# EAGLE design proiect_tsc (EAGLE 9.7.0)

## Sheet 1 of 2
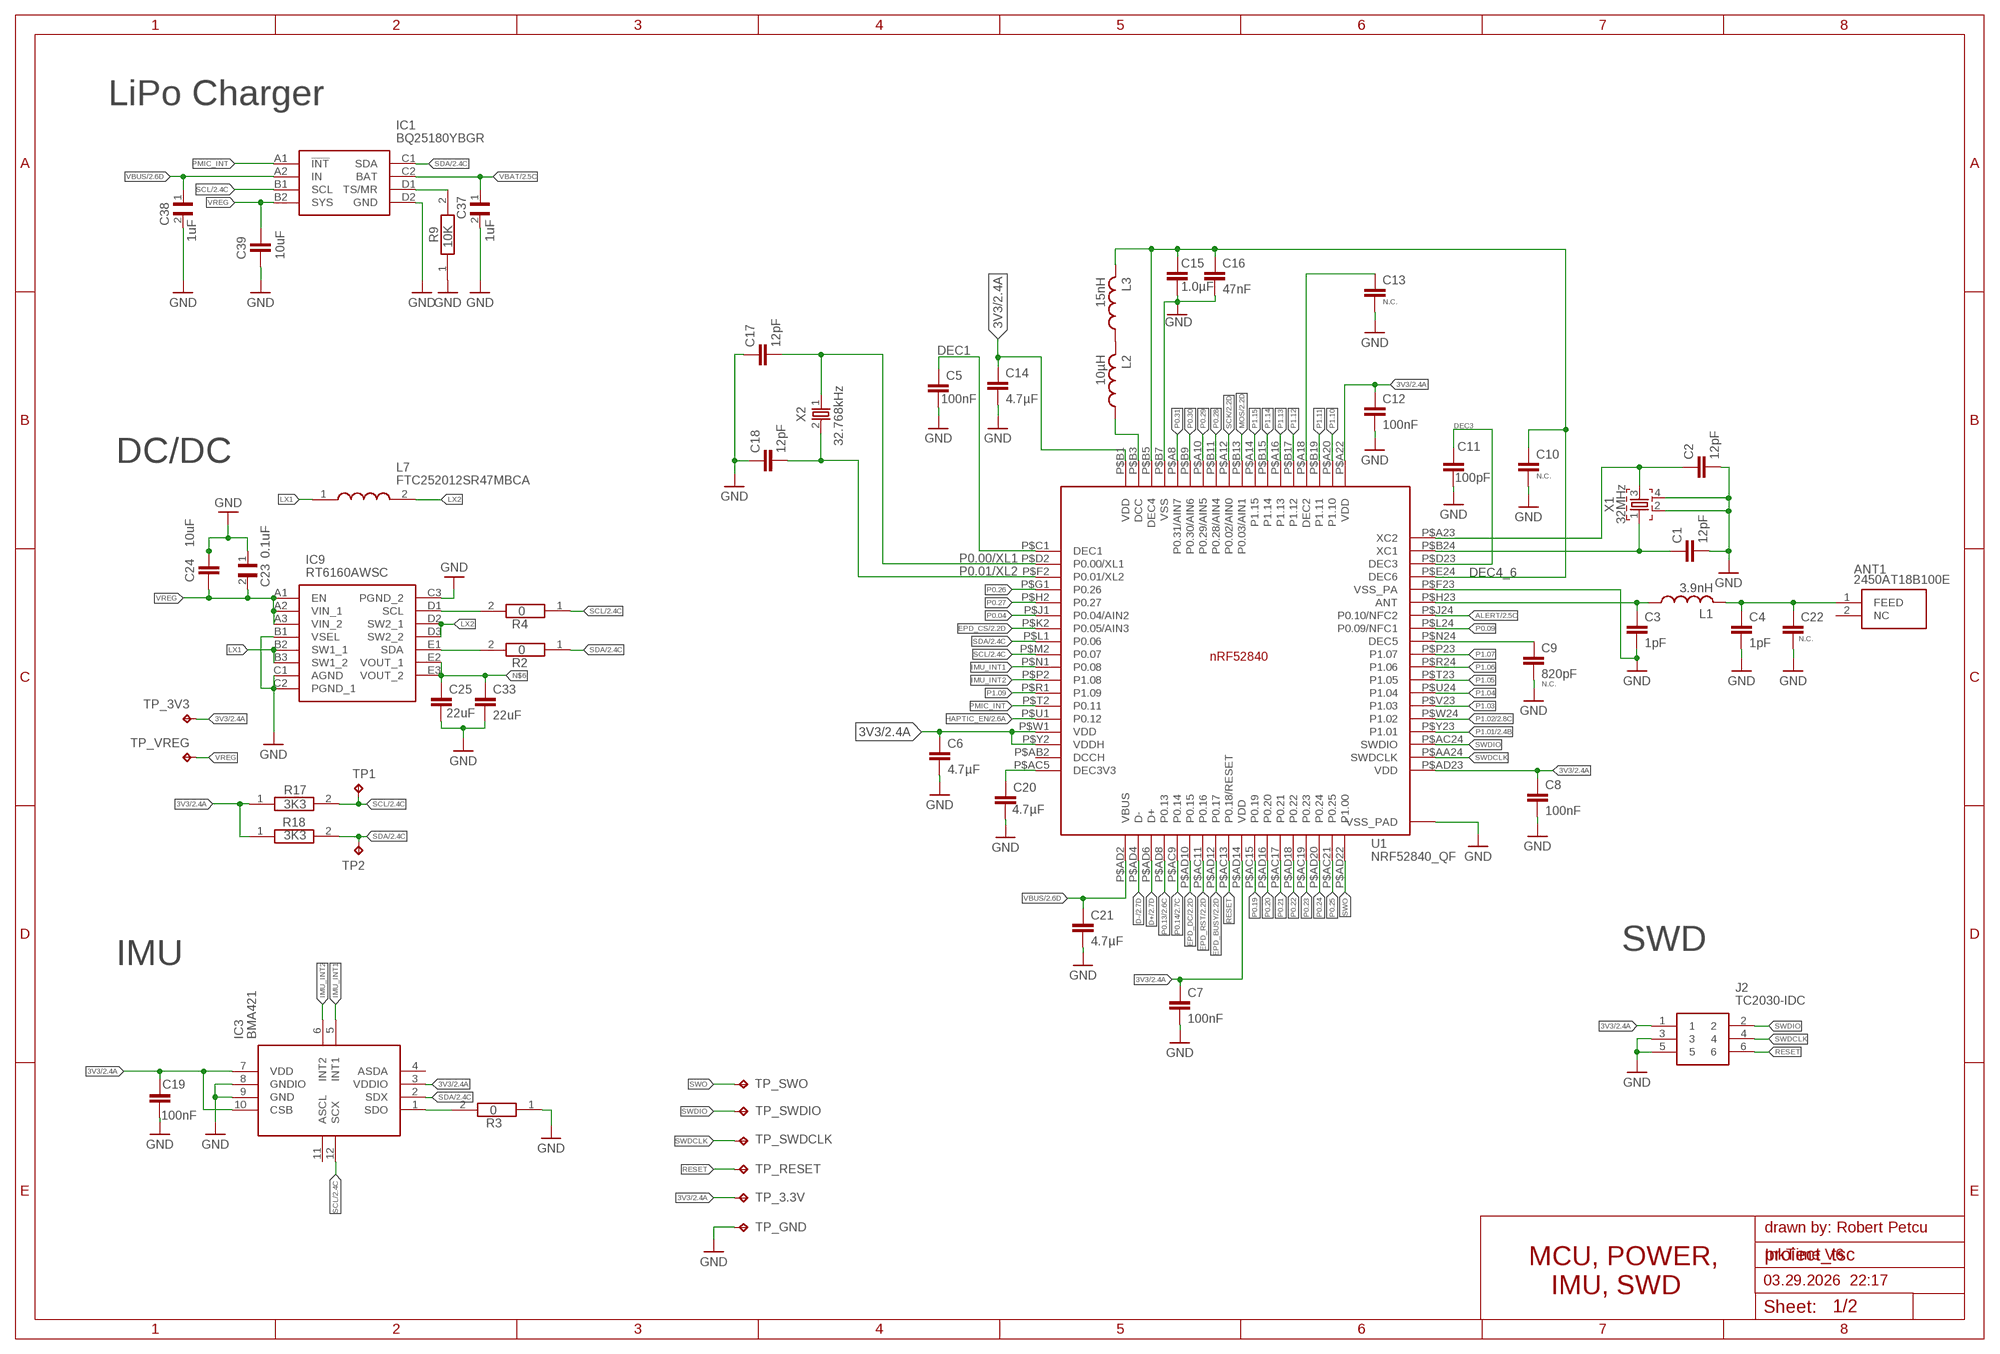
[diagram p0: schematic, sheet 1]

### Parts
ANT1  2450AT18B100E  2450AT18B100E_2450AT18B100E  [2450AT18B100E_ANTC3216X140N]
C1  12pF  NORDIC_NRF_3_CAPACITOR_0201_L  [NORDIC_NRF_3_RESC0201_L]
C2  12pF  NORDIC_NRF_3_CAPACITOR_0201_L  [NORDIC_NRF_3_RESC0201_L]
C3  1pF  NORDIC_NRF_3_CAPACITOR_0201_L  [NORDIC_NRF_3_RESC0201_L]
C4  1pF  NORDIC_NRF_3_CAPACITOR_0201_L  [NORDIC_NRF_3_RESC0201_L]
C5  100nF  NORDIC_NRF_3_CAPACITOR_0201_L  [NORDIC_NRF_3_RESC0201_L]
C6  4.7µF  PERFECT_0402_CAP_0402  [PERFECT_0402_0402]
C7  100nF  NORDIC_NRF_3_CAPACITOR_0201_L  [NORDIC_NRF_3_RESC0201_L]
C8  100nF  NORDIC_NRF_3_CAPACITOR_0201_L  [NORDIC_NRF_3_RESC0201_L]
C9  820pF  NORDIC_NRF_3_CAPACITOR_0201_L  [NORDIC_NRF_3_RESC0201_L]
C10  NORDIC_NRF_3_CAPACITOR_0201_L  [NORDIC_NRF_3_RESC0201_L]
C11  100pF  NORDIC_NRF_3_CAPACITOR_0201_L  [NORDIC_NRF_3_RESC0201_L]
C12  100nF  NORDIC_NRF_3_CAPACITOR_0201_L  [NORDIC_NRF_3_RESC0201_L]
C13  NORDIC_NRF_3_CAPACITOR_0201_L  [NORDIC_NRF_3_RESC0201_L]
C14  4.7µF  PERFECT_0402_CAP_0402  [PERFECT_0402_0402]
C15  1.0µF  PERFECT_0402_CAP_0402  [PERFECT_0402_0402]
C16  47nF  NORDIC_NRF_3_CAPACITOR_0201_L  [NORDIC_NRF_3_RESC0201_L]
C17  12pF  NORDIC_NRF_3_CAPACITOR_0201_L  [NORDIC_NRF_3_RESC0201_L]
C18  12pF  NORDIC_NRF_3_CAPACITOR_0201_L  [NORDIC_NRF_3_RESC0201_L]
C19  100nF  NORDIC_NRF_3_CAPACITOR_0201_L  [NORDIC_NRF_3_RESC0201_L]
C20  4.7µF  PERFECT_0402_CAP_0402  [PERFECT_0402_0402]
C21  4.7µF  PERFECT_0402_CAP_0402  [PERFECT_0402_0402]
C22  NORDIC_NRF_3_CAPACITOR_0201_L  [NORDIC_NRF_3_RESC0201_L]
C23  0.1uF  GRM011R60J152KE01L_1_GRM011R60J152KE01L  [GRM011R60J152KE01L_1_0201]
C24  10uF  PERFECT_0402_CAP_0402  [PERFECT_0402_0402]
C25  22uF  PERFECT_0402_CAP_0402  [PERFECT_0402_0402]
C33  22uF  PERFECT_0402_CAP_0402  [PERFECT_0402_0402]
C37  1uF  GRM011R60J152KE01L_1_GRM011R60J152KE01L  [GRM011R60J152KE01L_1_0201]
C38  1uF  GRM011R60J152KE01L_1_GRM011R60J152KE01L  [GRM011R60J152KE01L_1_0201]
C39  10uF  PERFECT_0402_CAP_0402  [PERFECT_0402_0402]
IC1  BQ25180YBGR  BQ25180YBGR_BQ25180YBGR  [BQ25180YBGR_BGA8C40P2X4_100X155X50]
IC3  BMA421  BMA423_BMA423  [BMA423_BMA423]
IC9  RT6160AWSC  RT6160AWSC_RT6160AWSC  [RT6160AWSC_BGA15C40P3X5_140X230X60]
J2  TC2030-IDC  TC2030-IDC_TC2030-IDC  [TC2030-IDC_TC2030IDC]
L1  3.9nH  NORDIC_NRF_2_INDUCTOR_0402_L  [NORDIC_NRF_2_RESC0402_L]
L2  10µH  NORDIC_NRF_2_INDUCTOR_0402_L  [NORDIC_NRF_2_RESC0402_L]
L3  15nH  NORDIC_NRF_2_INDUCTOR_0402_L  [NORDIC_NRF_2_RESC0402_L]
L7  FTC252012SR47MBCA  MLP2016SR47MT0S1_FTC252012SR47MBCA  [MLP2016SR47MT0S1_INDC2016X100N]
R2  0  CPF0201D7K68C1_CPF0201D7K68C1  [CPF0201D7K68C1_0201]
R3  0  CPF0201D7K68C1_CPF0201D7K68C1  [CPF0201D7K68C1_0201]
R4  0  CPF0201D7K68C1_CPF0201D7K68C1  [CPF0201D7K68C1_0201]
R9  10K  CPF0201D7K68C1_CPF0201D7K68C1  [CPF0201D7K68C1_0201]
R17  3K3  CPF0201D7K68C1_CPF0201D7K68C1  [CPF0201D7K68C1_0201]
R18  3K3  CPF0201D7K68C1_CPF0201D7K68C1  [CPF0201D7K68C1_0201]
TP1  HECTOR_WATCH_1_TPTP20R  [HECTOR_WATCH_1_TP20R]
TP2  HECTOR_WATCH_1_TPTP20R  [HECTOR_WATCH_1_TP20R]
TP_3.3V  HECTOR_WATCH_1_TPTP20R  [HECTOR_WATCH_1_TP20R]
TP_3V3  HECTOR_WATCH_1_TPTP20R  [HECTOR_WATCH_1_TP20R]
TP_GND  HECTOR_WATCH_1_TPTP20R  [HECTOR_WATCH_1_TP20R]
TP_RESET  HECTOR_WATCH_1_TPTP20R  [HECTOR_WATCH_1_TP20R]
TP_SWDCLK  HECTOR_WATCH_1_TPTP20R  [HECTOR_WATCH_1_TP20R]
TP_SWDIO  HECTOR_WATCH_1_TPTP20R  [HECTOR_WATCH_1_TP20R]
TP_SWO  HECTOR_WATCH_1_TPTP20R  [HECTOR_WATCH_1_TP20R]
TP_VREG  HECTOR_WATCH_1_TPTP20R  [HECTOR_WATCH_1_TP20R]
U1  NRF52840_QF  NORDIC_NRF_4_NRF52840_QF  [NORDIC_NRF_4_AQFN50P700X700X85_HS-74N]
X1  32MHz  NORDIC_NRF_XTAL_32MHZ  [NORDIC_NRF_BT-XTAL_2016_N]
X2  32.768kHz  NORDIC_NRF_1_XTAL_32KHZ  [NORDIC_NRF_1_XTAL_3215_N]

### Nets
3V3/2.4A [hi]: C6.1 C7.1 C8.1 C12.1 C14.1 C19.1 IC3.3(VDDIO) IC3.7(VDD) IC3.10(CSB) J2.1 R17.1 R18.1 TP_3.3V.TP TP_3V3.TP U1.P$A22(VDD) U1.P$AD14(VDD) U1.P$AD23(VDD) U1.P$B1(VDD) U1.P$W1(VDD) U1.P$Y2(VDDH)
ALERT/2.5C: U1.P$J24(P0.10/NFC2)
D+/2.7D: U1.P$AD6(D+)
D-/2.7D: U1.P$AD4(D-)
DEC1: C5.1 U1.P$C1(DEC1)
DEC3: C11.1 U1.P$D23(DEC3)
DEC4_6: C10.1 C15.1 C16.1 L3.2 U1.P$B5(DEC4) U1.P$E24(DEC6)
EPD_BUSY/2.2D: U1.P$AD12(P0.17)
EPD_CS/2.2D: U1.P$K2(P0.05/AIN3)
EPD_DC/2.2D: U1.P$AD10(P0.15)
EPD_RST/2.2D: U1.P$AC11(P0.16)
GND: C1.2 C2.2 C3.2 C4.2 C5.2 C6.2 C7.2 C8.2 C9.2 C10.2 C11.2 C12.2 C13.2 C14.2 C15.2 C16.2 C17.1 C18.1 C19.2 C20.2 C21.2 C22.2 C23.1 C24.1 C25.2 C33.2 C37.2 C38.2 C39.2 IC1.D2(GND) IC3.8(GNDIO) IC3.9(GND) IC9.B1(VSEL) IC9.C1(AGND) IC9.C2(PGND_1) IC9.C3(PGND_2) J2.3 J2.5 R3.1 R9.1 TP_GND.TP U1.P$74(VSS_PAD) U1.P$75(VSS_PAD) U1.P$76(VSS_PAD) U1.P$77(VSS_PAD) U1.P$78(VSS_PAD) U1.P$79(VSS_PAD) U1.P$80(VSS_PAD) U1.P$81(VSS_PAD) U1.P$82(VSS_PAD) U1.P$83(VSS_PAD) U1.P$84(VSS_PAD) U1.P$85(VSS_PAD) U1.P$86(VSS_PAD) U1.P$87(VSS_PAD) U1.P$88(VSS_PAD) U1.P$89(VSS_PAD) U1.P$90(VSS_PAD) U1.P$B7(VSS) U1.P$F23(VSS_PA) X1.2 X1.4 ; also sheet 2
HAPTIC_EN/2.6A: U1.P$U1(P0.12)
IMU_INT1: IC3.5(INT1) U1.P$N1(P0.08)
IMU_INT2: IC3.6(INT2) U1.P$P2(P1.08)
LX1: IC9.B2(SW1_1) IC9.B3(SW1_2) L7.1
LX2: IC9.D2(SW2_1) IC9.D3(SW2_2) L7.2
MOS/2.2D: U1.P$B13(P0.03/AIN1)
N$1: IC9.D1(SCL) R4.2
N$2: IC9.E1(SDA) R2.2
N$3: IC1.D1(TS/MR) R9.2
N$6: C25.1 C33.1 IC9.E2(VOUT_1) IC9.E3(VOUT_2)
N$7: L2.1 U1.P$B3(DCC)
N$8: C20.1 U1.P$AC5(DEC3V3)
N$9: IC3.1(SDO) R3.2
N$10: L2.2 L3.1
N$11: C2.1 U1.P$A23(XC2) X1.3
N$12: C13.1 U1.P$A18(DEC2)
N$13: C9.1 U1.P$N24(DEC5)
N$15: C1.1 U1.P$B24(XC1) X1.1
N$16: C3.1 L1.1 U1.P$H23(ANT)
N$17: ANT1.1(FEED) C4.1 C22.1 L1.2
P0.00/XL1: C17.2 U1.P$D2(P0.00/XL1) X2.1
P0.01/XL2: C18.2 U1.P$F2(P0.01/XL2) X2.2
P0.04: U1.P$J1(P0.04/AIN2)
P0.09: U1.P$L24(P0.09/NFC1)
P0.13/2.6C: U1.P$AD8(P0.13)
P0.14/2.7C: U1.P$AC9(P0.14)
P0.19: U1.P$AC15(P0.19)
P0.20: U1.P$AD16(P0.20)
P0.21: U1.P$AC17(P0.21)
P0.22: U1.P$AD18(P0.22)
P0.23: U1.P$AC19(P0.23)
P0.24: U1.P$AD20(P0.24)
P0.25: U1.P$AC21(P0.25)
P0.26: U1.P$G1(P0.26)
P0.27: U1.P$H2(P0.27)
P0.28: U1.P$B11(P0.28/AIN4)
P0.29: U1.P$A10(P0.29/AIN5)
P0.30: U1.P$B9(P0.30/AIN6)
P0.31: U1.P$A8(P0.31/AIN7)
P1.01/2.4B: U1.P$Y23(P1.01)
P1.02/2.8C: U1.P$W24(P1.02)
P1.03: U1.P$V23(P1.03)
P1.04: U1.P$U24(P1.04)
P1.05: U1.P$T23(P1.05)
P1.06: U1.P$R24(P1.06)
P1.07: U1.P$P23(P1.07)
P1.09: U1.P$R1(P1.09)
P1.10: U1.P$A20(P1.10)
P1.11: U1.P$B19(P1.11)
P1.12: U1.P$B17(P1.12)
P1.13: U1.P$A16(P1.13)
P1.14: U1.P$B15(P1.14)
P1.15: U1.P$A14(P1.15)
PMIC_INT: IC1.A1(!INT) U1.P$T2(P0.11)
RESET: J2.6 TP_RESET.TP U1.P$AC13(P0.18/RESET)
SCK/2.2D: U1.P$A12(P0.02/AIN0)
SCL/2.4C: IC1.B1(SCL) IC3.12(SCX) R4.1 R17.2 TP1.TP U1.P$M2(P0.07)
SDA/2.4C: IC1.C1(SDA) IC3.2(SDX) R2.1 R18.2 TP2.TP U1.P$L1(P0.06)
SWDCLK: J2.4 TP_SWDCLK.TP U1.P$AA24(SWDCLK)
SWDIO: J2.2 TP_SWDIO.TP U1.P$AC24(SWDIO)
SWO: TP_SWO.TP U1.P$AD22(P1.00)
VBAT/2.5C [hi]: C37.1 IC1.C2(BAT)
VBUS/2.6D [hi]: C21.1 C38.1 IC1.A2(IN) U1.P$AD2(VBUS)
VREG: C23.2 C24.2 C39.1 IC1.B2(SYS) IC9.A1(EN) IC9.A2(VIN_1) IC9.A3(VIN_2) TP_VREG.TP
Unconnected: ANT1.2(NC) IC3.4(ASDA) IC3.11(ASCL) U1.P$AB2(DCCH)

### Notes on the sheet
- LiPo Charger
- N.C.
- DC/DC
- N.C.
- N.C.
- N.C.
- SWD
- IMU
- drawn by: Robert Petcu
- InkTime V6
- 03.29.2026  22:17
- MCU, POWER,
     IMU, SWD

## Sheet 2 of 2
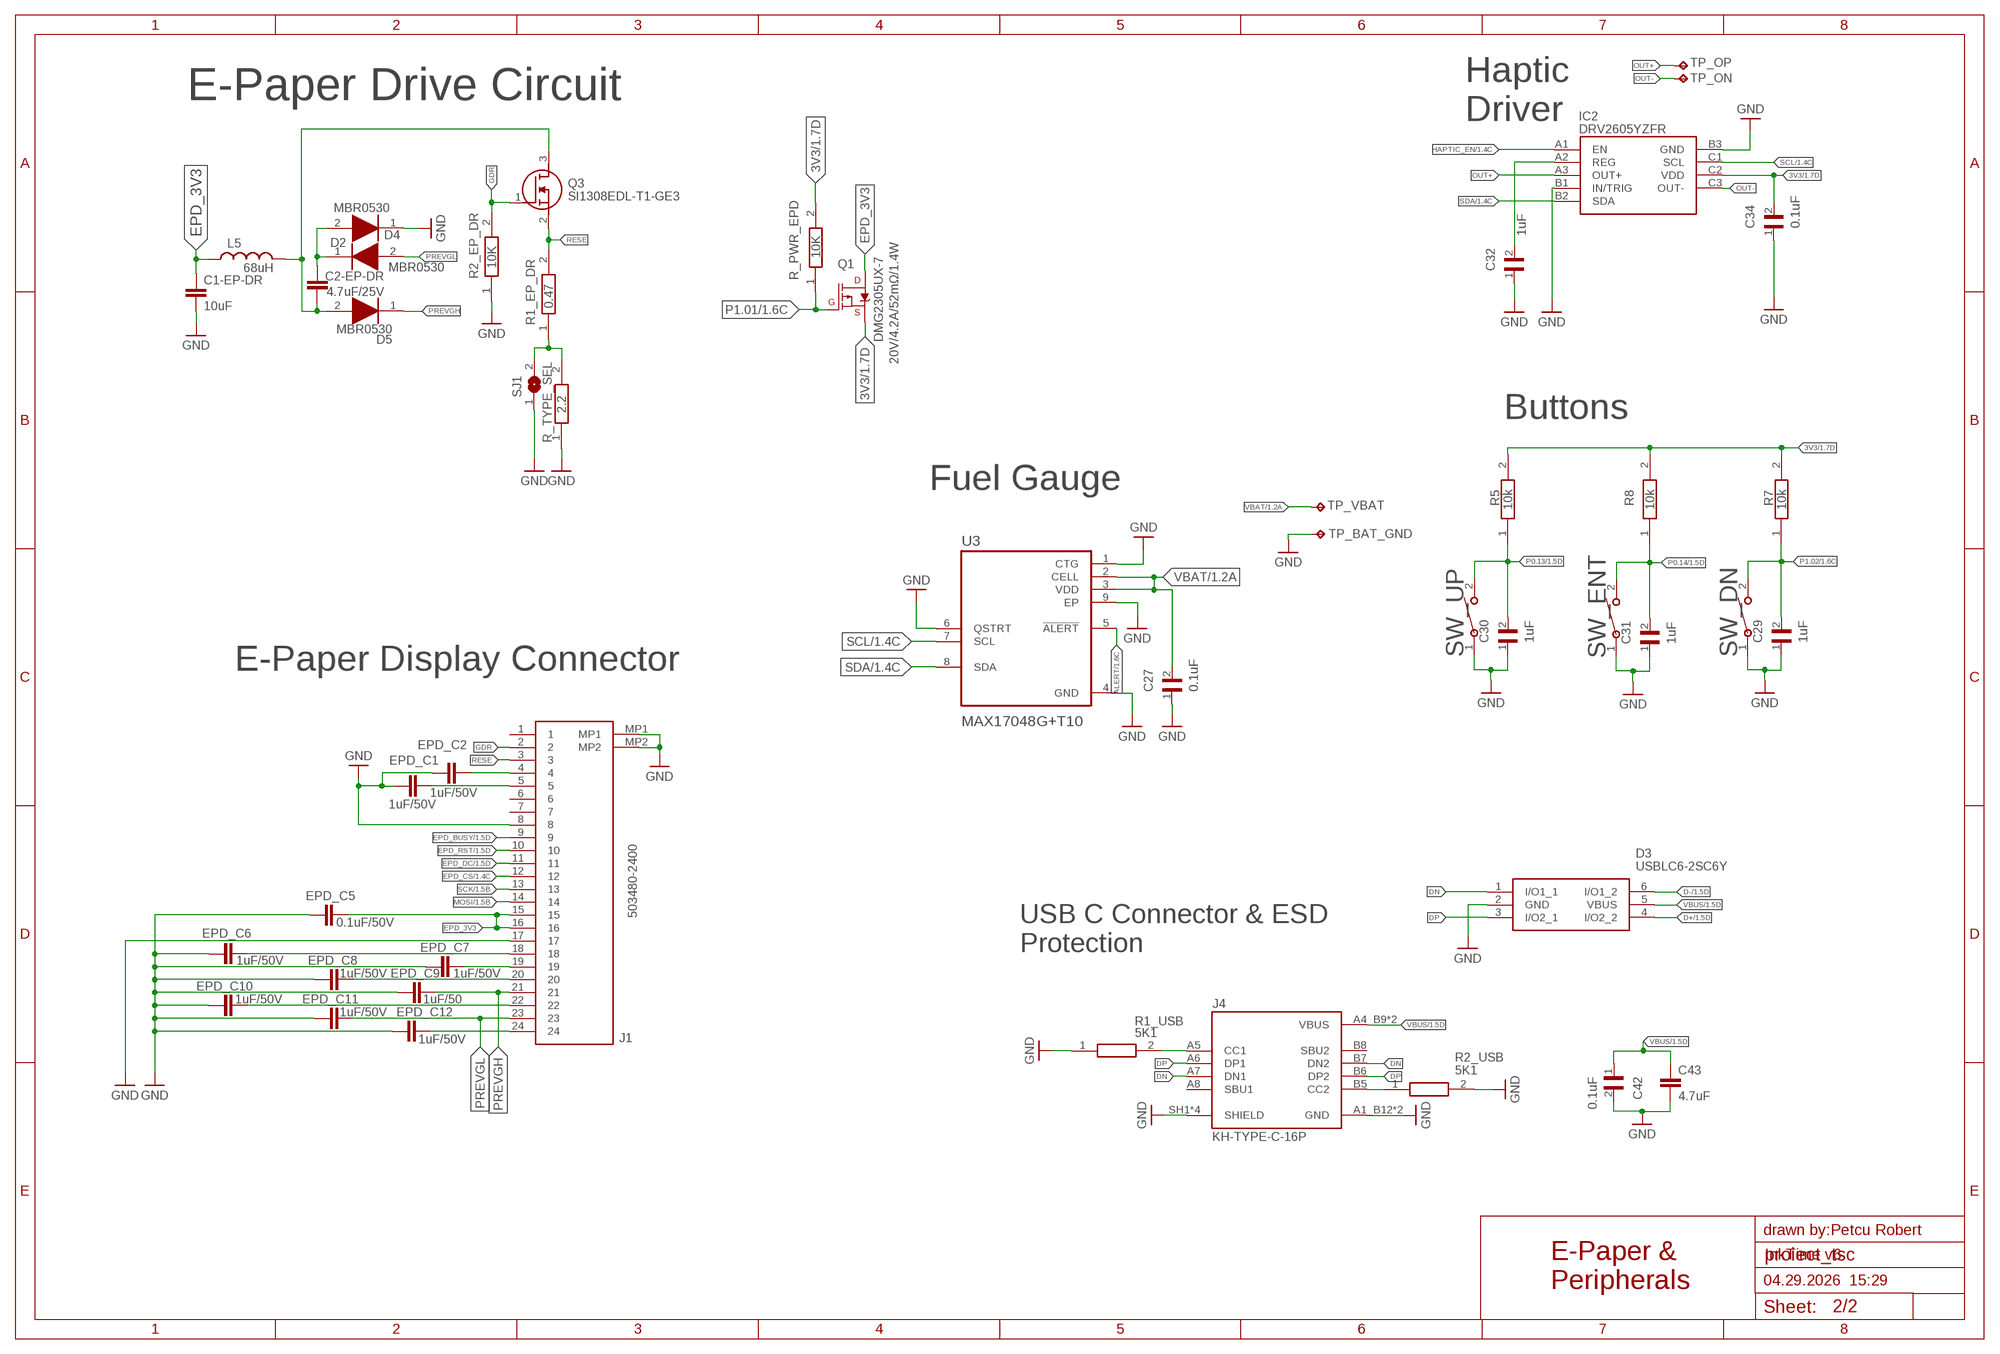
[diagram p1: schematic, sheet 2]

### Parts
C1-EP-DR  10uF  PERFECT_0402_CAP_0402  [PERFECT_0402_0402]
C2-EP-DR  4.7uF/25V  PERFECT_0402_CAP_0402  [PERFECT_0402_0402]
C27  0.1uF  GRM011R60J152KE01L_1_GRM011R60J152KE01L  [GRM011R60J152KE01L_1_0201]
C29  1uF  GRM011R60J152KE01L_1_GRM011R60J152KE01L  [GRM011R60J152KE01L_1_0201]
C30  1uF  GRM011R60J152KE01L_1_GRM011R60J152KE01L  [GRM011R60J152KE01L_1_0201]
C31  1uF  GRM011R60J152KE01L_1_GRM011R60J152KE01L  [GRM011R60J152KE01L_1_0201]
C32  1uF  GRM011R60J152KE01L_1_GRM011R60J152KE01L  [GRM011R60J152KE01L_1_0201]
C34  0.1uF  GRM011R60J152KE01L_1_GRM011R60J152KE01L  [GRM011R60J152KE01L_1_0201]
C42  0.1uF  GRM011R60J152KE01L_1_GRM011R60J152KE01L  [GRM011R60J152KE01L_1_0201]
C43  4.7uF  PERFECT_0402_CAP_0402  [PERFECT_0402_0402]
D2  MBR0530  ESP32_C6_LIBRARY_5_MBR0530  [ESP32_C6_LIBRARY_5_SOD3716X135N]
D3  USBLC6-2SC6Y  ESP32_C6_LIBRARY_3_USBLC6-2SC6Y  [ESP32_C6_LIBRARY_3_SOT95P280X145-6N]
D4  MBR0530  ESP32_C6_LIBRARY_5_MBR0530  [ESP32_C6_LIBRARY_5_SOD3716X135N]
D5  MBR0530  ESP32_C6_LIBRARY_5_MBR0530  [ESP32_C6_LIBRARY_5_SOD3716X135N]
DMG2305UX-7  20V/4.2A/52mΩ/1.4W  ESP32_C6_LIBRARY_4_ESP32_WROVER_SPARKFUN-DISCRETESEMI_MOSFET_PCH-DMG2305UX-7  [ESP32_C6_LIBRARY_4_ESP32_C6_LIBRARY_4_ESP32_C6_LIBRARY_4_ESP32_C6_LIBRARY_4_ESP32_WROVER_SPARKFUN-DISCRETESEMI_SOT23-3]
EPD_C1  1uF/50V  PERFECT_0402_CAP_0402  [PERFECT_0402_0402]
EPD_C2  1uF/50V  PERFECT_0402_CAP_0402  [PERFECT_0402_0402]
EPD_C5  0.1uF/50V  NORDIC_NRF_3_CAPACITOR_0201_L  [NORDIC_NRF_3_RESC0201_L]
EPD_C6  1uF/50V  PERFECT_0402_CAP_0402  [PERFECT_0402_0402]
EPD_C7  1uF/50V  PERFECT_0402_CAP_0402  [PERFECT_0402_0402]
EPD_C8  1uF/50V  PERFECT_0402_CAP_0402  [PERFECT_0402_0402]
EPD_C9  1uF/50  PERFECT_0402_CAP_0402  [PERFECT_0402_0402]
EPD_C10  1uF/50V  PERFECT_0402_CAP_0402  [PERFECT_0402_0402]
EPD_C11  1uF/50V  PERFECT_0402_CAP_0402  [PERFECT_0402_0402]
EPD_C12  1uF/50V  PERFECT_0402_CAP_0402  [PERFECT_0402_0402]
IC2  DRV2605YZFR  DRV2605YZFR_DRV2605YZFR  [DRV2605YZFR_BGA9C50P3X3_144X144X62]
J1  503480-2400  503480-2400_503480-2400  [503480-2400_5034802400]
J4  KH-TYPE-C-16P  KH-TYPE-C-16P_KH-TYPE-C-16P  [KH-TYPE-C-16P_KINGHELM_KH-TYPE-C-16P]
L5  68uH  NORDIC_NRF_2_INDUCTOR_0402_L  [NORDIC_NRF_2_RESC0402_L]
Q3  SI1308EDL-T1-GE3  ESP32_C6_LIBRARY_6_SI1308EDL-T1-GE3  [ESP32_C6_LIBRARY_6_SOT65P210X110-3N]
R1_EP_DR  0.47  CPF0201D7K68C1_CPF0201D7K68C1  [CPF0201D7K68C1_0201]
R1_USB  5K1  CPF0201D7K68C1_CPF0201D7K68C1  [CPF0201D7K68C1_0201]
R2_EP_DR  10K  CPF0201D7K68C1_CPF0201D7K68C1  [CPF0201D7K68C1_0201]
R2_USB  5K1  CPF0201D7K68C1_CPF0201D7K68C1  [CPF0201D7K68C1_0201]
R5  10k  CPF0201D7K68C1_CPF0201D7K68C1  [CPF0201D7K68C1_0201]
R7  10k  CPF0201D7K68C1_CPF0201D7K68C1  [CPF0201D7K68C1_0201]
R8  10k  CPF0201D7K68C1_CPF0201D7K68C1  [CPF0201D7K68C1_0201]
R_PWR_EPD  10K  CPF0201D7K68C1_CPF0201D7K68C1  [CPF0201D7K68C1_0201]
R_TYPE_SEL  2.2  CPF0201D7K68C1_CPF0201D7K68C1  [CPF0201D7K68C1_0201]
SJ1  ESP32_C6_LIBRARY_7_JUMPER_SJ  [ESP32_C6_LIBRARY_7_JUMPER_SJ]
SW_DN  2025-10-22_07-23-44_LIBRARY_EVP-AKE31ASW_EVP-AKE31A_PAN  [2025-10-22_07-23-44_LIBRARY_SW_EVP-AKE31A_PAN]
SW_ENT  2025-10-22_07-23-44_LIBRARY_EVP-AKE31ASW_EVP-AKE31A_PAN  [2025-10-22_07-23-44_LIBRARY_SW_EVP-AKE31A_PAN]
SW_UP  2025-10-22_07-23-44_LIBRARY_EVP-AKE31ASW_EVP-AKE31A_PAN  [2025-10-22_07-23-44_LIBRARY_SW_EVP-AKE31A_PAN]
TP_BAT_GND  HECTOR_WATCH_1_TPTP20R  [HECTOR_WATCH_1_TP20R]
TP_ON  HECTOR_WATCH_1_TPTP20R  [HECTOR_WATCH_1_TP20R]
TP_OP  HECTOR_WATCH_1_TPTP20R  [HECTOR_WATCH_1_TP20R]
TP_VBAT  HECTOR_WATCH_1_TPTP20R  [HECTOR_WATCH_1_TP20R]
U3  MAX17048G+T10  ESP32_C6_LIBRARY_MAX17048G+T10  [ESP32_C6_LIBRARY_SON50P200X200X80-9N]

### Nets
3V3/1.7D: C34.2 DMG2305UX-7.2(S) IC2.C2(VDD) R5.2 R7.2 R8.2 R_PWR_EPD.2
ALERT/1.6C: U3.5(!ALERT)
D+/1.5D: D3.4(I/O2_2)
D-/1.5D: D3.6(I/O1_2)
DN: D3.1(I/O1_1) J4.A7(DN1) J4.B7(DN2)
DP: D3.3(I/O2_1) J4.A6(DP1) J4.B6(DP2)
EPD_3V3: C1-EP-DR.1 DMG2305UX-7.3(D) EPD_C5.2 J1.15 J1.16 L5.1
EPD_BUSY/1.5D: J1.9
EPD_CS/1.4C: J1.12
EPD_DC/1.5D: J1.11
EPD_RST/1.5D: J1.10
GDR: J1.2 Q3.1(G) R2_EP_DR.2
GND: C1-EP-DR.2 C27.1 C29.1 C30.1 C31.1 C32.1 C34.1 C42.2 C43.2 D3.2(GND) D4.1(K) EPD_C1.1 EPD_C2.1 EPD_C5.1 EPD_C6.1 EPD_C7.1 EPD_C8.1 EPD_C9.1 EPD_C10.1 EPD_C11.1 EPD_C12.1 IC2.B1(IN/TRIG) IC2.B3(GND) J1.8 J1.17 J1.MP1 J1.MP2 J4.A1_B12(GND) J4.A12_B1(GND) J4.SH1(SHIELD) J4.SH2(SHIELD) J4.SH3(SHIELD) J4.SH4(SHIELD) R1_USB.1 R2_EP_DR.1 R2_USB.2 R_TYPE_SEL.1 SJ1.1 SW_DN.1 SW_ENT.1 SW_UP.1 TP_BAT_GND.TP U3.1(CTG) U3.4(GND) U3.6(QSTRT) U3.9(EP) ; also sheet 1
HAPTIC_EN/1.4C: IC2.A1(EN)
MOSI/1.5B: J1.14
N$14: C2-EP-DR.2 D5.2(A) L5.2 Q3.3(D)
N$18: C2-EP-DR.1 D2.1(K) D4.2(A)
N$19: EPD_C6.2 J1.18
N$20: R1_EP_DR.1 R_TYPE_SEL.2 SJ1.2
N$21: EPD_C2.2 J1.4
N$22: EPD_C1.2 J1.5
N$23: EPD_C7.2 J1.19
N$24: EPD_C8.2 J1.20
N$25: C32.2 IC2.A2(REG)
N$26: EPD_C10.2 J1.22
N$27: J4.A5(CC1) R1_USB.2
N$28: EPD_C12.2 J1.24
N$33: J4.B5(CC2) R2_USB.1
OUT+: IC2.A3(OUT+) TP_OP.TP
OUT-: IC2.C3(OUT-) TP_ON.TP
P0.13/1.5D: C30.2 R5.1 SW_UP.2
P0.14/1.5D: C31.2 R8.1 SW_ENT.2
P1.01/1.6C: DMG2305UX-7.1(G) R_PWR_EPD.1
P1.02/1.6C: C29.2 R7.1 SW_DN.2
PREVGH: D5.1(K) EPD_C9.2 J1.21
PREVGL: D2.2(A) EPD_C11.2 J1.23
RESE: J1.3 Q3.2(S) R1_EP_DR.2
SCK/1.5B: J1.13
SCL/1.4C: IC2.C1(SCL) U3.7(SCL)
SDA/1.4C: IC2.B2(SDA) U3.8(SDA)
VBAT/1.2A [hi]: C27.2 TP_VBAT.TP U3.2(CELL) U3.3(VDD)
VBUS/1.5D [hi]: C42.1 C43.1 D3.5(VBUS) J4.A4_B9(VBUS) J4.A9_B4(VBUS)
Unconnected: J1.1 J1.6 J1.7 J4.A8(SBU1) J4.B8(SBU2)

### Notes on the sheet
- E-Paper Drive Circuit
- Haptic 
  Driver
- Q1
- Buttons
- Fuel Gauge
- E-Paper Display Connector
- USB C Connector & ESD 
  Protection
- drawn by:Petcu Robert
- InkTime v6
- 04.29.2026  15:29
- E-Paper & 
  Peripherals

## Library data of the parts
ANT1 = InkTime_v5:2450AT18B100E_2450AT18B100E: Antennas 2.45GHz ANTENNA Source: Datasheet <https://www.johansontechnology.com/datasheets/2450AT18B100/2450AT18B100.pdf>; ARROW_PART_NUMBER: 2450AT18B100E; ARROW_PRICE-STOCK: https://www.arrow.com/en/products/2450at18b100e/johanson-dielectrics?utm_currency=USD&region=nac; DESCRIPTION: Antennas 2.45GHz ANTENNA; HEIGHT: 1.4mm; MANUFACTURER_NAME: JOHANSON TECHNOLOGY; MANUFACTURER_PART_NUMBER: 2450AT18B100E; MOUSER_PART_NUMBER: 609-2450AT18B100E; MOUSER_PRICE-STOCK: https://www.mouser.co.uk/ProductDetail/Johanson-Technology/2450AT18B100E?qs=yCnrNFeXz%252Bh5MFsFIXGZGA%3D%3D
C1-C5 C7-C13 C16-C19 C22 EPD_C5 = InkTime_v5:NORDIC_NRF_3_CAPACITOR: Generic chip capacitor
C1-EP-DR C2-EP-DR C6 C14 C15 C20 C21 C24 C25 C33 C39 C43 EPD_C1 EPD_C2 EPD_C6-EPD_C12 = InkTime_v5:PERFECT_0402_CAP_0402: 0402 (1005 Metric) Nick Garner - TeleSense
C23 C27 C29-C32 C34 C37 C38 C42 = InkTime_v5:GRM011R60J152KE01L_1_GRM011R60J152KE01L: Check availability <https://pricing.snapeda.com/parts/GRM011R60J152KE01L/Murata/view-part?ref=eda>
D2 D4 D5 = InkTime_v5:ESP32_C6_LIBRARY_5_MBR0530: ON SEMICONDUCTOR - MBR0530 - DIODE, SCHOTTKY, 0.5A, 30V, SOD-123 Source: Datasheet <http://www.onsemi.com/pub/Collateral/MBR0530T1-D.PDF> Check availability <https://pricing.snapeda.com/parts/MBR0530/ON%20Semiconductor/view-part?ref=eda>; AVAILABILITY: In Stock; CHECK_PRICES: https://www.snapeda.com/parts/MBR0530/Onsemi/view-part/?ref=eda; DESCRIPTION: Diode Schottky 30 V 500mA Surface Mount SOD-123; MF: ON Semiconductor; MP: MBR0530; PACKAGE: SOD-123-2 ON Semiconductor; PRICE: None; PURCHASE-URL: https://www.snapeda.com/api/url_track_click_mouser/?unipart_id=179458&manufacturer=ON Semiconductor&part_name=MBR0530&search_term=None; SNAPEDA_LINK: https://www.snapeda.com/parts/MBR0530/Onsemi/view-part/?ref=snap
D3 = InkTime_v5:ESP32_C6_LIBRARY_3_USBLC6-2SC6Y: Low Cap. ESD Protection Auto SOT-23-6 STMicroelectronics USBLC6-2SC6Y, Dual Uni-Directional TVS Diode Array, 6-Pin SOT-23 Source: Datasheet <https://componentsearchengine.com/Datasheets/1/USBLC6-2SC6Y.pdf> Check availability <https://pricing.snapeda.com/parts/USBLC6-2SC6Y/STMicroelectronics/view-part?ref=eda>; AVAILABILITY: In Stock; CHECK_PRICES: https://www.snapeda.com/parts/USBLC6-2SC6Y/STMicroelectronics/view-part/?ref=eda; DESCRIPTION: 17V Clamp 5A (8/20µs) Ipp Tvs Diode Surface Mount SOT-23-6; MF: STMicroelectronics; MP: USBLC6-2SC6Y; PACKAGE: SOT-23-6 STMicroelectronics; PRICE: None; SNAPEDA_LINK: https://www.snapeda.com/parts/USBLC6-2SC6Y/STMicroelectronics/view-part/?ref=snap
DMG2305UX-7 = InkTime_v5:ESP32_C6_LIBRARY_4_ESP32_WROVER_SPARKFUN-DISCRETESEMI_MOSFET_PCH: P-channel MOSFETs Voltage controlled devices that allow control of high current outputs. SparkFun Products: SparkFun ESP32 Thing <https://www.sparkfun.com/products/13907> SparkFun ESP8266 Thing <https://www.sparkfun.com/products/13231> SparkFun Pi Servo HAT V2 <https://www.sparkfun.com/products/15316> DMG2305UX-7 (20V/4.2A/SOT23-3); PROD_ID: TRAN-14388
IC1 = InkTime_v5:BQ25180YBGR_BQ25180YBGR: Charger IC Lithium Ion/Polymer, Lithium Iron Phosphate 8-DSBGA (1.6x1.1) Source: Datasheet <https://www.ti.com/lit/ds/symlink/bq25180.pdf?ts=1650264094470&ref_url=https%3A%2F%2Fwww.ti.com%2Fproduct%2FBQ25180>; ARROW_PART_NUMBER: BQ25180YBGR; ARROW_PRICE-STOCK: https://www.arrow.com/en/products/bq25180ybgr/texas-instruments?utm_currency=USD&region=nac; DESCRIPTION: Charger IC Lithium Ion/Polymer, Lithium Iron Phosphate 8-DSBGA (1.6x1.1); HEIGHT: 0.5mm; MANUFACTURER_NAME: Texas Instruments; MANUFACTURER_PART_NUMBER: BQ25180YBGR; MOUSER_PART_NUMBER: 595-BQ25180YBGR; MOUSER_PRICE-STOCK: https://www.mouser.co.uk/ProductDetail/Texas-Instruments/BQ25180YBGR?qs=doiCPypUmgEWjAK%252BJAX6Tw%3D%3D
IC2 = InkTime_v5:DRV2605YZFR_DRV2605YZFR: Haptic Driver for ERM/LRA with Built-In Library and Smart Loop Architecture Source: Datasheet <http://www.ti.com/lit/gpn/drv2605>; ARROW_PART_NUMBER: DRV2605YZFR; ARROW_PRICE-STOCK: https://www.arrow.com/en/products/drv2605yzfr/texas-instruments?region=nac; DESCRIPTION: Haptic Driver for ERM/LRA with Built-In Library and Smart Loop Architecture; HEIGHT: 0.625mm; MANUFACTURER_NAME: Texas Instruments; MANUFACTURER_PART_NUMBER: DRV2605YZFR
IC3 = InkTime_v5:BMA423_BMA423: Accelerometers Triaxial low-g 12bit Acceleration Sensor Source: Datasheet <https://www.mouser.com/datasheet/2/783/BST-BMA423-DS000-1509600.pdf>; ARROW_PART_NUMBER: BMA423; ARROW_PRICE-STOCK: https://www.arrow.com/en/products/bma423/bosch; DESCRIPTION: Accelerometers Triaxial low-g 12bit Acceleration Sensor; HEIGHT: 1mm; MANUFACTURER_NAME: BOSCH; MANUFACTURER_PART_NUMBER: BMA423; MOUSER_PART_NUMBER: 262-BMA423; MOUSER_PRICE-STOCK: https://www.mouser.co.uk/ProductDetail/Bosch-Sensortec/BMA423?qs=HXFqYaX1Q2xC%252BSgeGoX3mg%3D%3D
IC9 = InkTime_v5:RT6160AWSC_RT6160AWSC: Buck-Boost Regulator Positive Output Step-Up/Step-Down I2C DC-DC Controller IC 15-WL-CSP (BSC) (1.4x2.3) Source: Datasheet <https://www.richtek.com/SaveDownload.aspx?specid=RT6160A>; DESCRIPTION: Buck-Boost Regulator Positive Output Step-Up/Step-Down I2C DC-DC Controller IC 15-WL-CSP (BSC) (1.4x2.3); HEIGHT: 0.6mm; MANUFACTURER_NAME: RICHTEK; MANUFACTURER_PART_NUMBER: RT6160AWSC; MOUSER_PART_NUMBER: 835-RT6160AWSC; MOUSER_PRICE-STOCK: https://www.mouser.co.uk/ProductDetail/Richtek/RT6160AWSC?qs=amGC7iS6iy%2FLd9PSoixZXQ%3D%3D
J1 = InkTime_v5:503480-2400_503480-2400: FFC & FPC Connectors 0.5mm FPC RA SMT Dual Contact 24Ckt Source: Datasheet <https://componentsearchengine.com/Datasheets/1/503480-2400.pdf>; DESCRIPTION: FFC & FPC Connectors 0.5mm FPC RA SMT Dual Contact 24Ckt; HEIGHT: 1.87mm; MANUFACTURER_NAME: Molex; MANUFACTURER_PART_NUMBER: 503480-2400; MOUSER_PART_NUMBER: 538-503480-2400; MOUSER_PRICE-STOCK: https://www.mouser.co.uk/ProductDetail/Molex/503480-2400?qs=OAhjpuo3Vu7efIoxFh9AOw%3D%3D
J2 = InkTime_v5:TC2030-IDC_TC2030-IDC: CABLE ADAPTER 6 POS Source: Datasheet <https://datasheet.datasheetarchive.com/originals/distributors/Datasheets_SAMA/62bc384e093448baaaa63dbd0b9d8707.pdf>; DESCRIPTION: CABLE ADAPTER 6 POS; HEIGHT: 19mm; MANUFACTURER_NAME: Tag Connect; MANUFACTURER_PART_NUMBER: TC2030-IDC
J4 = InkTime_v5:KH-TYPE-C-16P_KH-TYPE-C-16P: Check availability <https://pricing.snapeda.com/parts/KH-TYPE-C-16P/kinghelm/view-part?ref=eda>; AVAILABILITY: Not in stock; CHECK_PRICES: https://www.snapeda.com/parts/KH-TYPE-C-16P/Kinghelm/view-part/?ref=eda; MF: kinghelm; MP: KH-TYPE-C-16P; PACKAGE: None; PRICE: None; SNAPEDA_LINK: https://www.snapeda.com/parts/KH-TYPE-C-16P/Kinghelm/view-part/?ref=snap
L1-L3 L5 = InkTime_v5:NORDIC_NRF_2_INDUCTOR: Generic chip inductor
L7 = InkTime_v5:MLP2016SR47MT0S1_FTC252012SR47MBCA: SMD / SMT Inductors (Coils), L=0.47?H, L x W x T : Source: Datasheet <https://product.tdk.com/system/files/dam/doc/product/inductor/inductor/smd/catalog/inductor_commercial_power_mlp2016_en.pdf>; DESCRIPTION: SMD / SMT Inductors (Coils), L=0.47?H, L x W x T :; HEIGHT: 1mm; JLCPCB: https://jlcpcb.com/partdetail/6763488-FTC252012SR47MBCA/C5832368; MANUFACTURER_NAME: TDK; MANUFACTURER_PART_NUMBER: FTC252012SR47MBCA
Q3 = InkTime_v5:ESP32_C6_LIBRARY_6_SI1308EDL-T1-GE3: MOSFET N-Ch 30V 1.5A TrenchFET SC70 Vishay Si1308EDL-T1-GE3 N-channel MOSFET Transistor, 1.5 A, 30 V, 3-Pin SC-70 Source: Datasheet <https://componentsearchengine.com/Datasheets/1/SI1308EDL-T1-GE3.pdf> Check availability <https://pricing.snapeda.com/parts/SI1308EDL-T1-GE3/Vishay%20Siliconix/view-part?ref=eda>; AVAILABILITY: In Stock; CHECK_PRICES: https://www.snapeda.com/parts/SI1308EDL-T1-GE3/Vishay+Siliconix/view-part/?ref=eda; DESCRIPTION: Si1308EDL-T1-GE3 N-channel MOSFET Transistor, 1.5 A, 30 V, 3-Pin SC-70 | Siliconix / Vishay SI1308EDL-T1-GE3; MF: Vishay Siliconix; MP: SI1308EDL-T1-GE3; PACKAGE: SOT-323 Vishay Semiconductor; PRICE: None; PURCHASE-URL: https://www.snapeda.com/api/url_track_click_mouser/?unipart_id=274603&manufacturer=Vishay Siliconix&part_name=SI1308EDL-T1-GE3&search_term=None; SNAPEDA_LINK: https://www.snapeda.com/parts/SI1308EDL-T1-GE3/Vishay+Siliconix/view-part/?ref=snap
R1_EP_DR R1_USB R2 R2_EP_DR R2_USB R3-R5 R7-R9 R17 R18 R_PWR_EPD R_TYPE_SEL = InkTime_v5:CPF0201D7K68C1_CPF0201D7K68C1: 7.68k 0201 Thin Film Surface Mount Fixed Resistor +/-0.5% 0.031W CPF0201D7K68C1 Source: Datasheet <http://www.te.com/commerce/DocumentDelivery/DDEController?Action=showdoc&DocId=Data Sheet1773200-1ApdfEnglishENG_DS_1773200-1_A.pdf4-2176215-6>
SJ1 = InkTime_v5:ESP32_C6_LIBRARY_7_JUMPER_SJ: SMD solder JUMPER
SW_DN SW_ENT SW_UP = InkTime_v5:2025-10-22_07-23-44_LIBRARY_EVP-AKE31A; COPYRIGHT: Copyright (C) 2025 Ultra Librarian. All rights reserved.; DIGI-KEY_PART_NUMBER_1: P123437TR-ND; DIGI-KEY_PART_NUMBER_2: P123437CT-ND; DIGI-KEY_PART_NUMBER_3: P123437DKR-ND; MANUFACTURER_NAME: Panasonic; MANUFACTURER_PART_NUMBER: EVP-AKE31A
TP1 TP2 TP_3.3V TP_3V3 TP_BAT_GND TP_GND TP_ON TP_OP TP_RESET TP_SWDCLK TP_SWDIO TP_SWO TP_VBAT TP_VREG = InkTime_v5:HECTOR_WATCH_1_TP: Test pad
U1 = InkTime_v5:NORDIC_NRF_4_NRF52840_QF: nRF52840 Features Advanced Single chip 2.4 GHz multi-protocol SoC 32-bit ARM Cortex-M4F Processor 1.7v to 5.5v operation 1MB flash + 256kB RAM Bluetooth 5 support for long range and high throughput 802.15.4 radio support On-chip NFC PPI –Programmable Peripheral Interconnect Automated power management system with automatic power management of each peripheral Configurable I/O mapping for analog and digital I/O 48 x GPIO 1 x QSPI 4 x Master/Slave SPI 2 x Two-wire interface (I²C) I²S interface 2 x UART 4 x PWM USB 2.0 controller ARM TrustZone CryptoCell-310 Cryptographic and security module AES 128-bit ECB/CCM/AAR hardware accelerator Digital microphone interface (PDM) Quadrature decoder 12-bit ADC Low power comparator On-chip 50Ω balun On-air compatible with nRF52, nRF51 and nRF24 Series Applications Advanced high performance wearables Wearables for secure payments Virtual Reality/Augmented Reality systems Smart Home sensor networks Smart city sensor networks High performance HID controllers Internet of Things (IoT) sensor networks Smart door locks Smart lighting networks Connected white goods
U3 = InkTime_v5:ESP32_C6_LIBRARY_MAX17048G+T10: Check availability <https://pricing.snapeda.com/parts/MAX17048G%2BT10/Analog%20Devices/view-part?ref=eda>; AVAILABILITY: In Stock; CHECK_PRICES: https://www.snapeda.com/parts/MAX17048G+T10/Analog+Devices/view-part/?ref=eda; DESCRIPTION: 3µA 1-Cell/2-Cell Fuel Gauge with ModelGauge; MF: Analog Devices; MP: MAX17048G+T10; PACKAGE: TDFN-8 Maxim; PRICE: None; PURCHASE-URL: https://www.snapeda.com/api/url_track_click_mouser/?unipart_id=329239&manufacturer=Analog Devices&part_name=MAX17048G+T10&search_term=None; SNAPEDA_LINK: https://www.snapeda.com/parts/MAX17048G+T10/Analog+Devices/view-part/?ref=snap
X1 = InkTime_v5:NORDIC_NRF_XTAL_32MHZ
X2 = InkTime_v5:NORDIC_NRF_1_XTAL_32KHZ

## Net classes
1 hi: width 0.3 mm

## Board
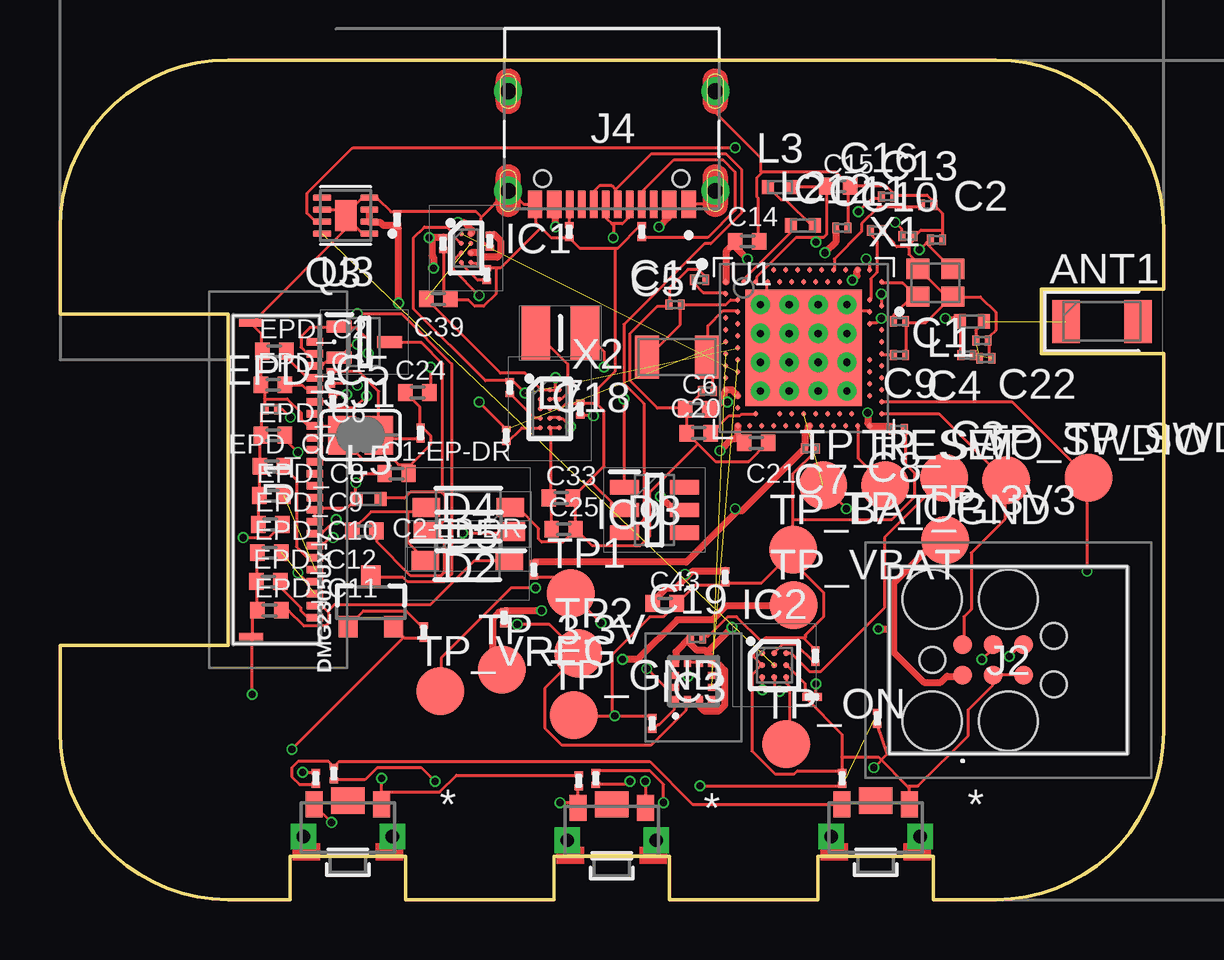
[diagram p2: board, top side]
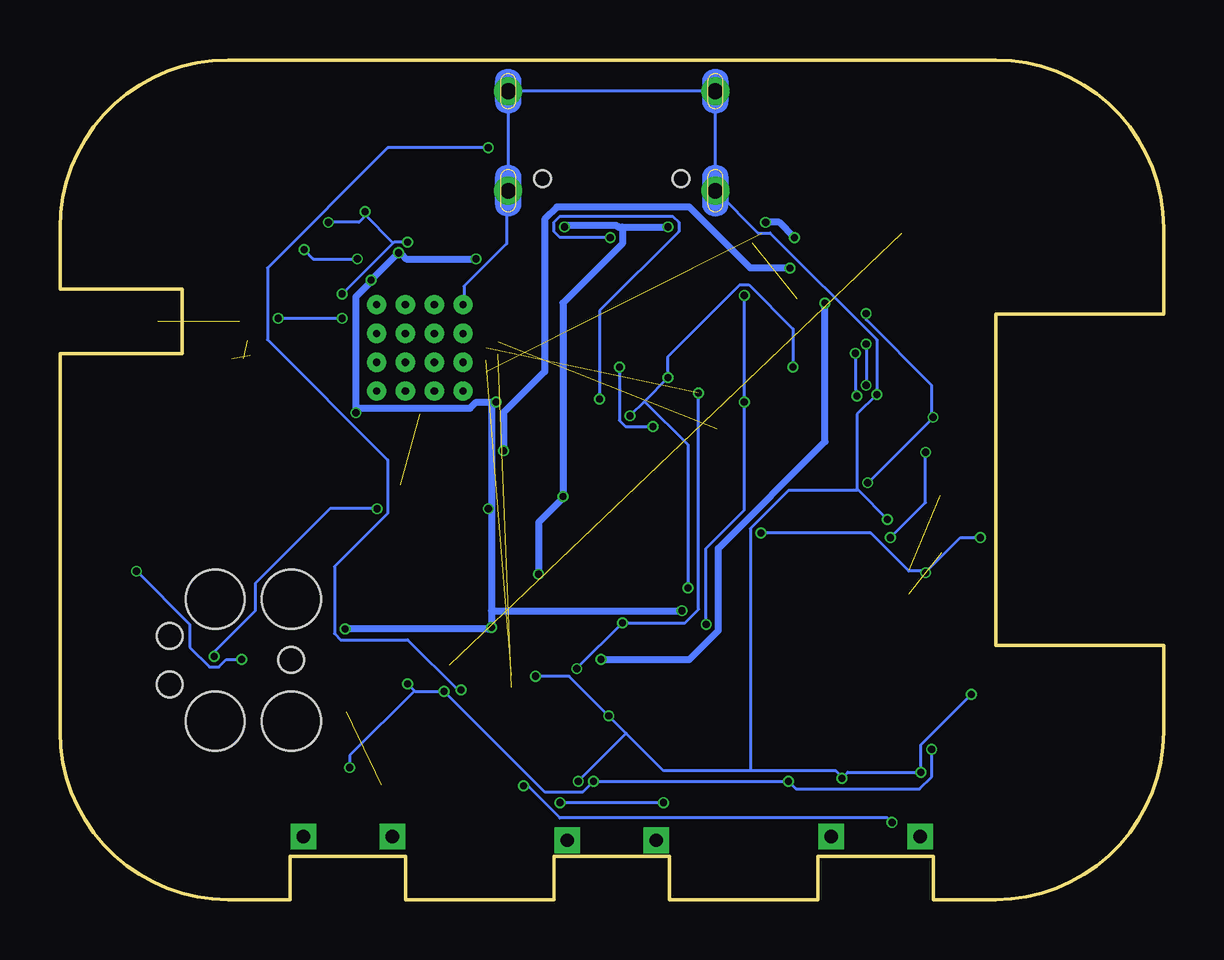
[diagram p3: board, bottom side, seen from below]

Size 46 x 35 mm. Coordinates in mm from the lower left corner, seen from the top.
Outline: 7,35 39,35 arc-90 46,28 46,25.45 40.9,25.45 40.9,22.75 46,22.75 46,7 arc-90 39,0 36.4,0 36.4,1.8 31.6,1.8 31.6,0 25.4,0 25.4,1.8 20.6,1.8 20.6,0 14.4,0 14.4,1.8 9.6,1.8 9.6,0 7,0 arc-90 0,7 0,10.6 7,10.6 7,24.4 0,24.4 0,28 arc-90 7,35
Copper layers (1*16): Top 0.035mm / dielectric 1.6mm / Bottom 0.035mm
Design rules "jlcpcb-2layers.dru": minimum track width 5mil, minimum drill 0.3mm, track to track 5mil, track to pad 5mil, pad to pad 5mil, via to via 5mil, smd to smd 5mil, copper to edge 0.2mm, drill to drill 6mil, minimum pad ring 10mil, minimum via ring 3mil, stop-mask expansion 4mil, vias tented up to drill 0mil, thermal gap 10mil

### Footprints (pad centres in the part's own frame; a part is rotated, then mirrored left to right if it is on the bottom)
2450AT18B100E_ANTC3216X140N = smd 1.15 x 1.8: 1 -1.5,0; 2 1.5,0
NORDIC_NRF_3_RESC0201_L = smd 0.28 x 0.43: 1 -0.255,0; 2 0.255,0
PERFECT_0402_0402 = smd 0.6 x 0.7: 1 -0.5,0; 2 0.5,0
GRM011R60J152KE01L_1_0201 = smd 0.35 x 0.25: 1 0,0.275; 2 0,-0.275
ESP32_C6_LIBRARY_5_SOD3716X135N = smd 1.15 x 0.8: 1 -1.75,0; 2 1.75,0
ESP32_C6_LIBRARY_3_SOT95P280X145-6N = smd 1.2 x 0.6: 1 -1.25,0.95; 2 -1.25,0; 3 -1.25,-0.95; 4 1.25,-0.95; 5 1.25,0; 6 1.25,0.95
ESP32_C6_LIBRARY_4_ESP32_C6_LIBRARY_4_ESP32_C6_LIBRARY_4_ESP32_C6_LIBRARY_4_ESP32_WROVER_SPARKFUN-DISCRETESEMI_SOT23-3 = smd 0.8 x 0.9: 1 -0.95,-1; 2 0.95,-1; 3 0,1.1
BQ25180YBGR_BGA8C40P2X4_100X155X50 = smd 0.2 x 0.2: A1 -0.2,0.6; A2 0.2,0.6; B1 -0.2,0.2; B2 0.2,0.2; C1 -0.2,-0.2; C2 0.2,-0.2; D1 -0.2,-0.6; D2 0.2,-0.6
DRV2605YZFR_BGA9C50P3X3_144X144X62 = smd 0.25 x 0.25: A1 -0.5,0.5; A2 0,0.5; A3 0.5,0.5; B1 -0.5,0; B2 0,0; B3 0.5,0; C1 -0.5,-0.5; C2 0,-0.5; C3 0.5,-0.5
BMA423_BMA423 = smd 0.3 x 0.35: 1 -0.75,-0.775; 2 -0.25,-0.775; 3 0.25,-0.775; 4 0.75,-0.775; 7 0.75,0.775; 8 0.25,0.775; 9 -0.25,0.775; 10 -0.75,0.775 | smd 0.35 x 0.3: 5 0.775,-0.25; 6 0.775,0.25; 11 -0.775,0.25; 12 -0.775,-0.25
RT6160AWSC_BGA15C40P3X5_140X230X60 = smd 0.216 x 0.216: A1 -0.4,0.8; A2 0,0.8; A3 0.4,0.8; B1 -0.4,0.4; B2 0,0.4; B3 0.4,0.4; C1 -0.4,0; C2 0,0; C3 0.4,0; D1 -0.4,-0.4; D2 0,-0.4; D3 0.4,-0.4; E1 -0.4,-0.8; E2 0,-0.8; E3 0.4,-0.8
503480-2400_5034802400 = smd 0.3 x 0.7: 1 -5.75,1.525; 2 -5.25,1.525; 3 -4.75,1.525; 4 -4.25,1.525; 5 -3.75,1.525; 6 -3.25,1.525; 7 -2.75,1.525; 8 -2.25,1.525; 9 -1.75,1.525; 10 -1.25,1.525; 11 -0.75,1.525; 12 -0.25,1.525; 13 0.25,1.525; 14 0.75,1.525; 15 1.25,1.525; 16 1.75,1.525; 17 2.25,1.525; 18 2.75,1.525; 19 3.25,1.525; 20 3.75,1.525; 21 4.25,1.525; 22 4.75,1.525; 23 5.25,1.525; 24 5.75,1.525 | smd 0.3 x 1: MP1 -6.54,-1.125; MP2 6.54,-1.125
TC2030-IDC_TC2030IDC = smd 0.783 x 0.783: 1 -0.953,-0.635; 2 -0.953,0.635; 3 0.317,-0.635; 4 0.317,0.635; 5 1.588,-0.635; 6 1.588,0.635 | hole 2.451: -2.223,-2.54; -2.223,2.54; 0.952,-2.54; 0.952,2.54 | hole 1.067: -2.223,0; 2.857,-1.016; 2.857,1.016
KH-TYPE-C-16P_KINGHELM_KH-TYPE-C-16P = smd 0.6 x 1.15: A1_B12 -3.2,4.725; A4_B9 -2.4,4.725; A9_B4 2.4,4.725; A12_B1 3.2,4.725 | smd 0.3 x 1.15: A5 -1.25,4.725; A6 -0.25,4.725; A7 0.25,4.725; A8 1.25,4.725; B5 1.75,4.725; B6 0.75,4.725; B7 -0.75,4.725; B8 -1.75,4.725 | drill 0.65 pad 1.05: SH1 -4.32,0; SH2 4.32,0; SH3 -4.32,4.15; SH4 4.32,4.15 | hole 0.7: -2.89,3.65; 2.89,3.65
NORDIC_NRF_2_RESC0402_L = smd 0.5 x 0.6: 1 -0.5,0; 2 0.5,0
MLP2016SR47MT0S1_INDC2016X100N = smd 1.2 x 2.2: 1 -1.028,0; 2 1.028,0
ESP32_C6_LIBRARY_6_SOT65P210X110-3N = smd 1.05 x 0.5: 1 -1.05,0.65; 2 -1.05,-0.65; 3 1.05,0
CPF0201D7K68C1_0201 = smd 0.35 x 0.25: 1 0,0.275; 2 0,-0.275
ESP32_C6_LIBRARY_7_JUMPER_SJ = smd 1.168 x 1.6: 1 -0.762,0; 2 0.762,0
2025-10-22_07-23-44_LIBRARY_SW_EVP-AKE31A_PAN = smd 0.711 x 1.092: 1 -1.4,-0.972; 2 1.4,-0.972 | drill 0.559 pad 0.914 square: 3 -1.848,0.381; 4 1.848,0.381 | smd 1.397 x 1.092: 5 0,-1.124
HECTOR_WATCH_1_TP20R = smd 2 x 2: TP 0,0
NORDIC_NRF_4_AQFN50P700X700X85_HS-74N = smd 4.85 x 4.85: P$74 0,0 | drill 0.3 pad 0.6: P$75 -1.8,1.8; P$76 -0.6,1.8; P$77 0.6,1.8; P$78 1.8,1.8; P$79 -1.8,0.6; P$80 -0.6,0.6; P$81 0.6,0.6; P$82 1.8,0.6; P$83 -1.8,-0.6; P$84 -0.6,-0.6; P$85 0.6,-0.6; P$86 1.8,-0.6; P$87 -1.8,-1.8; P$88 -0.6,-1.8; P$89 0.6,-1.8; P$90 1.8,-1.8 | smd 0.2 x 0.2: P$A8 -1.25,3.25; P$A10 -0.75,3.25; P$A12 -0.25,3.25; P$A14 0.25,3.25; P$A16 0.75,3.25; P$A18 1.25,3.25; P$A20 1.75,3.25; P$A22 2.25,3.25; P$A23 2.75,3.25; P$AA24 3.25,-2.25; P$AB2 -2.75,-2.5; P$AC5 -2,-2.75; P$AC9 -1,-2.75; P$AC11 -0.5,-2.75; P$AC13 0,-2.75; P$AC15 0.5,-2.75; P$AC17 1,-2.75; P$AC19 1.5,-2.75; P$AC21 2,-2.75; P$AC24 3.25,-2.75; P$AD2 -2.75,-3.25; P$AD4 -2.25,-3.25; P$AD6 -1.75,-3.25; P$AD8 -1.25,-3.25; P$AD10 -0.75,-3.25; P$AD12 -0.25,-3.25; P$AD14 0.25,-3.25; P$AD16 0.75,-3.25; P$AD18 1.25,-3.25; P$AD20 1.75,-3.25; P$AD22 2.25,-3.25; P$AD23 2.75,-3.25; P$B1 -3.25,2.75; P$B3 -2.5,2.75; P$B5 -2,2.75; P$B7 -1.5,2.75; P$B9 -1,2.75; P$B11 -0.5,2.75; P$B13 0,2.75; P$B15 0.5,2.75; P$B17 1,2.75; P$B19 1.5,2.75; P$B24 3.25,2.75; P$C1 -3.25,2.25; P$D2 -2.75,2; P$D23 2.75,2; P$E24 3.25,1.75; P$F2 -2.75,1.5; P$F23 2.75,1.5; P$G1 -3.25,1.25; P$H2 -2.75,1; P$H23 2.75,1; P$J1 -3.25,0.75; P$J24 3.25,0.75; P$K2 -2.75,0.5; P$L1 -3.25,0.25; P$L24 3.25,0.25; P$M2 -2.75,0; P$N1 -3.25,-0.25; P$N24 3.25,-0.25; P$P2 -2.75,-0.5; P$P23 2.75,-0.5; P$R1 -3.25,-0.75; P$R24 3.25,-0.75; P$T2 -2.75,-1; P$T23 2.75,-1; P$U1 -3.25,-1.25; P$U24 3.25,-1.25; P$V23 2.75,-1.5; P$W1 -3.25,-1.75; P$W24 3.25,-1.75; P$Y2 -2.75,-2; P$Y23 2.75,-2
ESP32_C6_LIBRARY_SON50P200X200X80-9N = smd 0.76 x 0.27: 1 -0.985,0.75; 2 -0.985,0.25; 3 -0.985,-0.25; 4 -0.985,-0.75; 5 0.985,-0.75; 6 0.985,-0.25; 7 0.985,0.25; 8 0.985,0.75 | smd 0.9 x 1.3: 9 0,0
NORDIC_NRF_BT-XTAL_2016_N = smd 0.95 x 0.85: 1 -0.725,-0.575; 2 0.725,-0.575; 3 0.725,0.575; 4 -0.725,0.575
NORDIC_NRF_1_XTAL_3215_N = smd 1 x 1.8: 1 -1.25,0; 2 1.25,0

### Placement (x,y rotation side)
ANT1  43.43,24.1 0 top
C1  34.99,24.1 0 top
C1-EP-DR  14.03,17.76 0 top
C2  36.54,27.5 0 top
C2-EP-DR  12.68,15.36 0 top
C3  37.81,22.7 0 top
C4  38.43,23.3 0 top
C5  26.66,25.84 0 top
C6  26.56,20.44 180 top
C7  31.29,18.8 0 top
C8  34.94,19.6 0 top
C9  34.99,22.7 0 top
C10  35.35,27.66 0 top
C11  34.04,27.9 0 top
C12  32.59,28 0 top
C13  36.17,28.96 0 top
C14  28.65,27.44 0 top
C15  32.44,29.74 0 top
C16  34.49,29.3 0 top
C17  25.64,24.8 0 top
C18  26.99,21.2 0 top
C19  26.54,10.9 0 top
C20  26.63,19.44 180 top
C21  29.02,19.04 0 top
C22  38.59,22.56 0 top
C23  21.69,20.45 0 top
C24  14.9,21.14 0 top
C25  20.99,15.44 0 top
C27  14.05,28.35 0 top
C29  32.61,5.05 0 top
C30  10.67,5.05 0 top
C31  21.63,4.95 0 top
C32  31.49,10.15 0 top
C33  20.88,16.74 0 top
C34  31.35,8.45 90 top
C37  17.91,27.45 0 top
C38  15.97,27.35 0 top
C39  15.77,25.04 0 top
C42  27.73,13.45 0 top
C43  25.21,12.34 0 top
D2  16.98,14.14 0 top
D3  24.78,16.24 0 top
D4  17.02,16.34 180 top
D5  17.06,15.34 180 top
DMG2305UX-7  12.96,12.38 0 top
EPD_C1  8.88,21.46 0 top
EPD_C2  8.93,22.86 0 top
EPD_C5  8.81,20.44 0 top
EPD_C6  8.88,19.36 0 top
EPD_C7  8.83,18.06 0 top
EPD_C8  8.82,16.84 0 top
EPD_C9  8.77,15.64 0 top
EPD_C10  8.73,14.46 0 top
EPD_C11  8.73,12.06 0 top
EPD_C12  8.68,13.26 0 top
IC1  16.93,27.16 0 top
IC2  29.78,9.77 0 top
IC3  26.41,9.1 0 top
IC9  20.42,20.46 0 top
J1  9.1,17.5 270 top
J2  38.58,9.98 0 top
J4  23,33.7 180 top
L1  38.02,24.1 0 top
L2  30.97,28.1 0 top
L3  30.02,29.7 0 top
L5  12.87,16.7 0 top
L7  20.86,23.61 0 top
Q3  12.69,23.24 0 top
R1_EP_DR  11.29,21.75 0 top
R1_USB  24.25,27.85 0 top
R2  18.61,19.35 0 top
R2_EP_DR  11.37,20.75 0 top
R2_USB  21.23,27.85 0 top
R3  24.69,7.35 0 top
R4  18.75,21.35 0 top
R5  11.41,5.25 0 top
R7  34.07,7.55 0 top
R8  22.33,5.05 0 top
R9  17.79,26.05 0 top
R17  19.75,13.75 0 top
R18  18.51,11.75 0 top
R_PWR_EPD  15.17,11.15 0 top
R_TYPE_SEL  15.03,19.45 0 top
SJ1  12.53,19.36 0 top
SW_DN  12,3 180 top
SW_ENT  23,2.85 180 top
SW_UP  34,3 180 top
TP1  21.29,12.76 0 top
TP2  21.61,10.26 0 top
TP_3.3V  18.42,9.58 0 top
TP_3V3  36.9,14.98 0 top
TP_BAT_GND  30.57,14.58 0 top
TP_GND  21.41,7.68 0 top
TP_ON  30.28,6.48 0 top
TP_OP  36.86,17.58 0 top
TP_RESET  31.81,17.28 0 top
TP_SWDCLK  42.87,17.58 0 top
TP_SWDIO  39.44,17.48 0 top
TP_SWO  34.4,17.28 0 top
TP_VBAT  30.59,12.28 0 top
TP_VREG  15.85,8.68 0 top
U1  31,23 0 top
U3  11.91,28.51 180 top
X1  36.49,25.71 0 top
X2  25.72,22.61 0 top

### Tracks (layer width: path | path; a pad name or v marks a point on that pad's centre or on a via)
3V3/1.7D  (via drill 0.3)
  Top 0.127: 14.33,10.93 13.92,11.34 DMG2305UX-7.2 | 14.33,10.93 14.36,10.9 15.13,10.9 R_PWR_EPD.2 | v29.98,8.67 29.8,8.86 29.8,9.24 IC2.C2 | v31.51,8.99 31.51,8.55 31.57,8.48 C34.2 | v23.76,4.93 23.64,4.8 22.36,4.8 R8.2 | v15.63,4.93 15.06,5.5 13.22,5.5 12.71,4.99 11.44,4.99 R5.2 | v33.92,5.5 34.49,6.07 R7.2 | v9.66,6.26 14.33,10.93
  Bottom 0.127: v31.51,8.99 31.22,8.71 | 31.22,8.71 31.19,8.67 v29.98,8.67 25.79,4.48 24.21,4.48 v23.76,4.93 v15.63,4.93 15.32,4.61 10.17,4.61 9.66,5.12 v9.66,6.26 | v33.92,5.5 33.92,6.01 31.22,8.71
3V3/2.4A  (via drill 0.3)
  Top 0.3: U1.P$AD14 31.19,19.72 31.19,19.59 31.06,19.47 31.06,18.82 C7.1 28.43,16.2 28.24,16.2 | 28.24,16.2 26.11,14.07 19.76,14.07 R17.1 | 34.75,11.28 34.75,13.18 36.52,14.96 36.84,14.96 TP_3V3.TP | 34.75,11.28 34.75,10.32 36.02,9.05 36.72,9.05 36.97,9.31 37.61,9.31 J2.1 | TP_3.3V.TP 18.36,9.63 18.05,9.94 18.05,11.72 18.3,11.98 18.49,11.98 R18.1 18.62,12.04 v20.08,12.04 | IC3.10 25.67,10.32 26.24,10.9 C19.1 26.24,10.71 26.56,10.39 26.87,10.39 26.97,10.29 | IC3.3 26.68,8.29 26.68,8.04 26.87,7.85 27.45,7.85 27.7,8.1 27.7,9.56 27.45,9.82 27.19,9.82 IC3.7 27.13,10.01 27.13,10.13 26.97,10.29 | U1.P$B1 27.76,25.76 27.76,27.02 28.14,27.41 C14.1 28.14,27.22 v28.65,26.71 | 27.76,21.25 28.02,21.25 28.21,21.06 U1.P$Y2 | 27.76,21.25 U1.P$W1 | 27.7,20.87 27.7,21.12 27.76,21.25 | 27.7,20.87 27.32,20.48 27.06,20.48 C6.1 | C8.1 34.68,19.66 34.62,19.72 33.8,19.72 U1.P$AD23 33.67,19.85 v33.67,20.29 | v33.03,25.82 33.22,26.01 33.22,26.2 U1.P$A22 | v31.89,26.96 32.34,27.41 32.34,27.98 C12.1 | v27.83,20.74 27.83,20.8 27.7,20.87 | v28.02,11.34 26.97,10.29 | v34.11,11.28 34.75,11.28 | v28.14,16.29 28.24,16.2
  Bottom 0.3: v28.65,26.71 31.57,26.71 31.76,26.9 v31.89,26.96 v33.03,25.82 33.1,25.69 33.67,25.12 v33.67,20.29 33.54,20.48 28.91,20.48 28.65,20.74 v27.83,20.74 28.02,20.61 28.02,16.29 | 28.02,16.29 28.02,12.04 | 28.02,12.04 v28.02,11.34 28.14,11.28 v34.11,11.28 | 28.02,12.04 v20.08,12.04 | v28.14,16.29 28.02,16.29
DEC1
  Top 0.127: U1.P$C1 27.7,25.31 26.81,25.31 26.43,25.69 26.43,25.82 C5.1
DEC3
  Top 0.127: U1.P$D23 33.8,25.06 33.8,25.88 34.05,26.14 34.05,27.47 33.8,27.72 33.8,27.85 C11.1
DEC4_6  (via drill 0.3)
  Top 0.127: 31.51,27.6 31.83,27.6 31.95,27.72 31.95,29.69 C15.1 31.89,29.69 30.56,29.69 L3.2 | 31.51,27.6 30.68,27.6 29.03,25.95 29.03,25.76 U1.P$B5 | v34.24,25.25 34.24,24.8 U1.P$E24 | 31.51,27.6 v31.51,27.41 | v33.29,28.68 33.86,29.25 34.18,29.25 C16.1 | v34.81,28.23 35.06,27.98 35.06,27.66 C10.1
  Bottom 0.127: 32.11,27.37 32.08,27.41 v31.51,27.41 | 32.11,27.37 v34.24,25.25 | 32.11,27.37 33.29,28.55 v33.29,28.68 33.29,28.49 33.54,28.23 v34.81,28.23
DN  (via drill 0.3)
  Top 0.127: 23.06,28.17 23.45,28.17 23.7,28.42 23.7,28.93 J4.B7 | 23.06,28.17 23,28.17 22.81,28.36 22.81,28.93 J4.A7 | v23.51,20.87 23.51,17.25 D3.1 | 23.06,28.17 v23.06,27.6
  Bottom 0.127: v23.51,20.87 23.51,24.55 20.21,27.85 20.21,28.23 20.46,28.49 25.16,28.49 25.41,28.23 25.41,27.85 25.16,27.6 v23.06,27.6
DP
  Top 0.127: 23.16,29.6 23.19,29.56 23.19,28.99 J4.A6 | 23.16,29.6 23,29.76 22.49,29.76 22.3,29.56 22.3,28.99 J4.B6 | 23.16,29.6 24.65,31.09 27.76,31.09 28.4,30.45 28.4,28.61 27.13,27.34 26.87,27.34 23.51,23.98 23.51,21.5 24.33,20.68 24.33,15.85 23.83,15.34 23.57,15.34 D3.3
EPD_3V3  (via drill 0.3)
  Top 0.127: J1.16 10.62,15.79 10.62,16.23 J1.15 10.68,16.29 11.95,16.29 12.33,16.67 L5.1 12.33,16.74 v12.33,17.37 12.71,17.75 13.47,17.75 C1-EP-DR.1 | v9.6,20.1 9.28,20.42 9.09,20.42 EPD_C5.2 | v12.4,24.42 14.24,24.42 16.33,22.33 16.33,13.56 16.02,13.25 14.49,13.25 14.3,13.44 12.97,13.44 DMG2305UX-7.3
  Bottom 0.127: v12.33,17.37 v9.6,20.1 9.66,20.1 9.66,21.44 12.4,24.17 v12.4,24.42
GDR  (via drill 0.3)
  Top 0.127: v12.78,20.99 12.27,20.48 R2_EP_DR.2 | v12.84,22.77 12.84,23.34 12.33,23.85 11.7,23.85 Q3.1 11.63,23.85 10.43,23.85 10.05,23.47 10.05,23.02 10.3,22.77 10.62,22.77 J1.2
  Bottom 0.127: v12.78,20.99 12.78,21.18 12.84,21.25 v12.84,22.77
GND  (via drill 0.3)  (1 unrouted)
  Top 0.127: EPD_C10.1 8.2,14.45 8.2,13.31 EPD_C12.1 8.2,13.25 8.2,12.1 EPD_C11.1 8.2,12.04 8.01,11.85 8.01,11.02 J1.MP2 8.01,10.96 v8.01,8.55 | IC3.8 26.62,9.88 26.18,9.88 IC3.9 26.18,9.82 v26.18,9.31 | v10.11,5.31 10.62,5.31 C30.1 | 13.41,4.48 13.41,3.97 SW_DN.1 13.41,4.48 | 13.41,4.48 v13.41,5.05 | 13.41,4.48 15.82,4.48 16.52,5.18 21.6,5.18 C31.1 | v24.4,4.93 24.4,3.85 SW_ENT.1 | J2.5 40.14,9.37 38.94,9.37 J2.3 38.88,9.31 38.88,8.93 37.86,7.91 37.86,6.83 35.76,4.74 35.38,4.74 35.35,4.71 | IC2.B3 30.3,9.75 31.06,8.99 31.06,8.48 C34.1 31.06,8.42 32.59,6.9 32.59,5.94 | 32.59,5.94 32.59,5.37 C29.1 32.52,5.37 30.75,5.37 30.62,5.24 29.8,5.24 28.84,6.2 28.84,9.37 29.22,9.75 IC2.B1 29.22,9.82 28.91,10.13 28.91,10.39 29.25,10.74 | 35.35,4.71 34.11,5.94 32.59,5.94 | 35.35,4.71 35.38,4.67 35.38,3.97 SW_UP.1 | 23,7.66 21.41,7.66 TP_GND.TP | 23,7.66 v23.13,7.66 24.65,7.66 R3.1 | 29.25,10.74 29.41,10.9 31,10.9 31.03,10.86 | 31.03,10.86 31.45,10.45 C32.1 | 29.25,10.74 28.21,11.79 27.83,11.79 27,10.96 26.81,10.96 C19.2 | 30.56,15.85 30.56,14.64 TP_BAT_GND.TP | 30.56,15.85 30.56,17.75 31.51,18.71 31.51,18.75 C7.2 | 30.56,15.85 34.68,15.85 35.64,16.8 35.64,17.75 35.26,18.14 35.26,19.59 C8.2 | TP_BAT_GND.TP 30.56,14.52 29.22,13.18 27.76,13.18 C42.2 27.7,13.12 26.49,13.12 25.73,12.36 C43.2 25.67,12.29 25.16,11.79 24.59,11.79 23,10.2 23,7.66 | 31.03,10.86 31.06,10.9 31.06,11.02 31.83,11.79 31.83,12.8 30.37,14.26 TP_BAT_GND.TP | C5.2 26.87,25.88 26.87,26.01 26.62,26.26 26.18,26.26 25.41,25.5 25.41,24.8 C17.1 25.35,24.74 24.91,24.74 23.76,23.6 23.76,21.63 24.91,20.48 26.05,20.48 C6.2
  Top 0.127: C18.1 26.68,21.18 26.68,21.06 26.11,20.48 C6.2 | C6.2 26.11,20.42 26.11,19.47 C20.2 26.18,19.41 26.59,18.99 | 26.59,18.99 27.32,18.26 28.71,18.26 29.48,19.02 C21.2 | IC9.B1 20.02,20.8 20.02,20.48 IC9.C1 20.08,20.48 20.4,20.48 IC9.C2 20.46,20.48 20.78,20.48 IC9.C3 20.84,20.42 21.09,20.68 21.67,20.68 C23.1 21.73,20.68 22.36,20.68 22.4,20.64 | C25.2 21.48,15.47 21.48,16.67 21.41,16.74 C33.2 21.41,16.8 22.08,17.47 | 22.4,20.64 22.68,20.36 22.68,18.07 22.08,17.47 | D4.1 18.81,16.29 19.13,16.29 19.95,15.47 19.95,15.02 20.08,14.9 20.97,14.9 21.48,15.4 C25.2 | 22.08,17.47 23.25,16.29 23.51,16.29 D3.2 | C38.2 16.02,27.02 16.02,25.31 16.27,25.06 C39.2 16.33,24.99 17.03,24.99 17.29,24.74 17.67,24.74 18.17,25.25 18.17,26.33 | IC1.D2 17.16,26.52 17.35,26.52 17.54,26.33 17.73,26.33 R9.1 18.17,26.33 | 20.05,28.01 19.82,28.23 19.82,28.93 J4.A12_B1 19.76,28.99 19.32,28.99 18.75,29.56 J4.SH4 18.62,29.5 17.57,28.45 | 20.05,28.01 20.46,27.6 21.22,27.6 R2_USB.2 21.29,27.53 21.67,27.15 23.13,27.15 | 23.13,27.15 23.25,27.15 24.21,28.1 R1_USB.1 | 18.17,26.33 18.36,26.33 20.05,28.01 | 23.13,27.15 23.13,22.01 22.43,21.31 22.43,20.68 22.4,20.64 | 26.59,18.99 24.59,16.99 24.59,15.15 24.21,14.77 22.17,14.77 21.54,15.4 C25.2 | 29.22,24.8 29.48,25.06 29.48,25.69 U1.P$B7 | U1.P$F23 33.73,24.55 33.03,24.55 32.84,24.74 U1.P$74 | U1.P$74 29.22,22.39 29.22,21.25 U1.P$87 29.29,21.25 30.37,21.25 U1.P$88 | U1.P$83 29.22,22.45 U1.P$74 | U1.P$79 29.22,23.66 29.8,24.23 U1.P$74 | 29.22,24.8 U1.P$75 | 29.22,24.8 U1.P$74 | U1.P$84 30.43,22.45 30.43,22.77 U1.P$74 | U1.P$74 31.64,22.39 31.64,21.25 U1.P$89 31.7,21.25 32.78,21.25 U1.P$90
  Top 0.127: U1.P$74 31.64,22.45 U1.P$85 31.7,22.45 32.78,22.45 U1.P$86 | U1.P$80 30.43,23.6 U1.P$74 | U1.P$76 30.37,24.74 29.86,24.23 U1.P$74 | U1.P$81 31.64,23.6 U1.P$74 | U1.P$77 31.64,24.74 32.21,24.17 U1.P$74 | U1.P$82 32.78,23.66 32.27,24.17 U1.P$74 | U1.P$78 32.84,24.8 U1.P$74 | 36.78,27.91 36.78,28.61 36.46,28.93 C13.2 36.4,28.99 36.4,29.12 36.14,29.37 34.87,29.37 34.81,29.31 C16.2 34.68,29.31 34.68,29.5 34.43,29.76 32.97,29.76 C15.2 | 36.78,27.91 36.78,27.53 C2.2 | 35.35,27.25 35.57,27.47 35.57,27.66 C10.2 35.64,27.66 35.89,27.91 36.78,27.91 | 35.35,27.25 35.32,27.22 34.87,27.22 34.75,27.34 34.75,27.41 34.3,27.85 C11.2 | 35.35,27.25 35.38,27.22 35.38,26.9 35.76,26.52 35.76,26.33 X1.4 35.83,26.26 37.03,25.06 X1.2 | C9.2 35.26,24.04 C1.2 35.32,24.04 36.08,24.04 37.16,25.12 X1.2 | C22.2 38.81,22.58 38.75,22.64 38.75,23.28 C4.2 38.75,23.34 38.75,23.47 39,23.72 39,24.48 38.37,25.12 37.22,25.12 X1.2 | J4.A1_B12 26.24,28.99 26.81,28.99 27.32,29.5 J4.SH3 | C12.2 32.84,28.04 32.84,29.63 32.91,29.69 C15.2 | 29.25,30.3 29.29,30.33 32.34,30.33 32.91,29.76 C15.2 | 29.25,30.3 29.03,30.07 29.03,29.31 29.1,29.25 29.1,27.47 C14.2 | J4.SH1 27.38,33.69 27.38,32.74 29.22,30.9 29.22,30.33 29.25,30.3 | C24.1 14.43,21.12 15,20.55 15,19.79 R_TYPE_SEL.1 15.06,19.72 15.44,19.34 15.44,18.96 14.59,18.1 | 14.59,18.1 14.55,18.07 14.55,17.82 C1-EP-DR.2 | EPD_C9.1 8.27,15.66 8.27,16.8 EPD_C8.1 8.33,16.86 8.33,18.01 EPD_C7.1 8.33,18.07 8.33,19.34 EPD_C6.1 8.39,19.41 8.39,20.29 8.52,20.42 EPD_C5.1 8.52,20.48 8.52,20.87 | 8.52,20.87 8.52,21.31 8.39,21.44 EPD_C1.1 8.39,21.5 8.39,22.83 EPD_C2.1 8.39,22.9 8.39,23.6 8.01,23.98 J1.MP1 8.01,24.04 12.14,28.17 U3.9
  Top 0.127: 8.52,20.87 9.47,20.87 10.05,20.29 10.05,20.04 10.3,19.79 10.62,19.79 J1.8 10.68,19.72 11.44,19.72 11.76,19.41 SJ1.1 11.82,19.34 11.82,19.15 12.65,18.33 13.92,18.33 14.11,18.14 14.55,18.14 14.59,18.1 | U3.1 12.84,27.79 12.59,27.79 11.89,28.49 U3.9 | U3.6 10.94,28.74 11.57,28.74 11.82,28.49 U3.9 | U3.9 11.89,28.55 12.59,29.25 12.84,29.25 U3.4 12.9,29.25 13.22,29.25 13.79,28.68 14.05,28.68 C27.1 14.11,28.68 17.35,28.68 17.57,28.45 | v11.95,21.06 11.38,21.06 R2_EP_DR.1 | 17.57,28.45 17.54,28.42 17.54,27.47 17.6,27.41 17.67,27.41 17.86,27.22 C37.2 | v11.51,15.85 10.94,15.28 10.68,15.28 J1.17
  Bottom 0.127: v26.18,9.31 24.78,9.31 v23.13,7.66 22.4,6.93 | 22.4,6.93 20.84,5.37 17.22,5.37 | 17.22,5.37 13.66,5.37 13.41,5.12 v13.41,5.05 13.16,5.31 v10.11,5.31 10.11,6.45 v8.01,8.55 | 22.4,6.93 v24.4,4.93 | U1.P$75 29.16,24.8 29.16,25.56 27.38,27.34 27.38,29.5 J4.SH3 27.32,29.56 J4.SH1 27.25,33.69 18.75,33.69 J4.SH2 18.68,29.56 J4.SH4 18.62,29.5 16.9,27.79 16.4,27.79 11.95,23.34 v11.95,21.06 12.78,20.23 12.78,17.12 12.74,17.09 | 12.74,17.09 v11.51,15.85 | 17.22,5.37 17.22,15.47 15.63,17.05 12.78,17.05 12.74,17.09
IMU_INT1  (1 unrouted)
IMU_INT2  (1 unrouted)
LX1
  Top 0.127: IC9.B2 20.46,20.87 20.78,20.87 IC9.B3 20.84,20.87 20.91,20.87 21.16,21.12 21.16,22.33 19.89,23.6 L7.1
LX2  (via drill 0.3)
  Top 0.127: IC9.D2 20.46,20.1 20.78,20.1 IC9.D3 20.84,20.04 20.97,20.04 v21.29,19.72 | v22.68,22.2 22.68,22.83 21.92,23.6 L7.2
  Bottom 0.127: v21.29,19.72 22.43,19.72 22.68,19.98 v22.68,22.2
N$1
  Top 0.127: IC9.D1 20.02,20.1 19.76,20.1 18.81,21.06 R4.2
N$2
  Top 0.127: IC9.E1 19.25,19.66 18.62,19.02 R2.2
N$3
  Top 0.127: IC1.D1 16.78,26.52 16.78,26.45 17.41,25.82 17.73,25.82 R9.2
N$6
  Top 0.127: IC9.E3 20.78,19.66 20.46,19.66 IC9.E2 20.46,19.59 20.46,16.86 20.4,16.8 C33.1 20.46,16.8 20.46,15.47 C25.1
N$7
  Top 0.127: U1.P$B3 28.52,25.76 28.52,25.88 30.43,27.79 30.43,28.04 L2.1
N$8
  Top 0.127: U1.P$AC5 28.97,20.23 28.4,20.23 28.33,20.17 27.89,20.17 27.19,19.47 C20.1
N$9
  Top 0.127: R3.2 24.71,7.09 24.91,7.28 24.97,7.28 25.6,7.91 25.6,8.29 IC3.1
N$10
  Top 0.127: L2.2 31.45,28.1 31.32,28.1 30.24,29.18 30.05,29.18 29.54,29.69 L3.1
N$11  (via drill 0.3)
  Top 0.127: v33.6,26.71 33.73,26.58 33.73,26.26 U1.P$A23 | 36.11,27.37 36.27,27.53 C2.1 | 36.11,27.37 v35.83,27.09 | 36.11,27.37 37.16,26.33 X1.3
  Bottom 0.127: v33.6,26.71 35.45,26.71 v35.83,27.09
N$12
  Top 0.127: U1.P$A18 32.27,26.26 32.27,26.71 33.41,27.85 33.41,28.17 34.11,28.87 35.83,28.87 35.89,28.93 C13.1
N$13
  Top 0.127: U1.P$N24 34.3,22.71 34.68,22.71 C9.1
N$14
  Top 0.127: 15.92,16.96 16.08,16.8 16.08,15.85 15.57,15.34 D5.2 15.63,15.34 16.02,14.96 16.02,13.63 15.89,13.5 14.62,13.5 13.22,14.9 13.22,15.34 C2-EP-DR.2 | 15.92,16.96 15.89,16.99 14.62,16.99 14.36,16.74 13.41,16.74 L5.2 | Q3.3 13.79,23.21 15.06,23.21 15.95,22.33 15.95,16.99 15.92,16.96
N$15
  Top 0.127: U1.P$B24 34.3,25.69 35.13,25.69 35.64,25.18 35.76,25.18 X1.1 35.57,25.18 34.75,24.36 34.75,24.1 C1.1
N$16  (via drill 0.3)
  Top 0.127: v34.24,24.23 34.05,24.04 33.8,24.04 U1.P$H23 | v36.91,24.23 37.35,24.23 37.48,24.1 L1.1 37.54,24.04 C3.1
  Bottom 0.127: v36.91,24.23 v34.24,24.23
N$17  (2 unrouted)
  Top 0.127: C4.1 38.18,23.34 38.18,23.72 38.49,24.04 L1.2
N$18
  Top 0.127: 14.49,16.17 15.13,16.17 15.25,16.29 D4.2 | 14.49,16.17 12.97,16.17 12.21,15.4 C2-EP-DR.1 | 14.49,16.17 14.49,14.9 15.19,14.2 D2.1
N$19  (via drill 0.3)
  Top 0.127: v9.92,18.64 9.41,19.15 9.41,19.34 EPD_C6.2 | v11.38,15.09 11.25,15.09 10.94,14.77 10.68,14.77 J1.18
  Bottom 0.127: v9.92,18.64 9.92,16.55 v11.38,15.09
N$20
  Top 0.127: R_TYPE_SEL.2 15,19.21 13.47,19.21 13.35,19.34 SJ1.2 13.28,19.41 13.28,21.18 12.46,22.01 11.32,22.01 R1_EP_DR.1
N$21
  Top 0.127: J1.4 10.3,21.75 9.47,22.58 9.47,22.83 EPD_C2.2
N$22
  Top 0.127: EPD_C1.2 9.41,21.44 10.11,21.44 10.24,21.31 10.62,21.31 J1.5
N$23
  Top 0.127: J1.19 10.62,14.26 10.3,14.26 9.86,14.71 9.86,17.5 9.35,18.01 EPD_C7.2
N$24  (1 unrouted)
N$25
  Top 0.127: IC2.A2 29.8,10.32 30.11,10.64 30.68,10.64 31.45,9.88 C32.2
N$26  (1 unrouted)
N$27
  Top 0.127: R1_USB.2 24.27,27.6 27,27.6 28.14,28.74 28.14,30.33 27.64,30.84 25.6,30.84 24.27,29.5 24.27,28.99 J4.A5
N$28
  Top 0.127: EPD_C12.2 9.22,13.25 9.22,12.99 10.05,12.17 10.05,12.04 10.3,11.79 10.62,11.79 J1.24
N$33
  Top 0.127: R2_USB.1 21.22,28.17 21.22,28.93 J4.B5
OUT+
  Top 0.127: IC2.A3 30.3,10.26 30.49,10.26 31.26,9.5 31.7,9.5 34.37,12.17 34.37,15.09 36.84,17.56 TP_OP.TP
OUT-
  Top 0.127: IC2.C3 30.3,9.24 30.3,8.99 30.43,8.86 30.43,6.64 30.3,6.51 TP_ON.TP
P0.00/XL1
  Top 0.127: U1.P$D2 28.21,24.99 27.95,24.99 27.76,24.8 25.92,24.8 C17.2 25.86,24.74 25.86,23.98 24.52,22.64 X2.1
P0.01/XL2
  Top 0.127: U1.P$F2 28.21,24.55 27.64,24.55 27,23.91 27,22.64 X2.2 27,22.58 27.19,22.39 27.19,21.25 C18.2
P0.13/1.5D
  Top 0.127: C30.2 10.62,4.8 9.98,4.8 9.66,5.12 9.66,5.5 9.92,5.75 11.19,5.75 11.38,5.56 R5.1 11.44,5.56 11.63,5.75 24.59,5.75 26.37,3.97 32.59,3.97 SW_UP.2
P0.14/1.5D  (via drill 0.3)
  Top 0.127: 21.6,4.04 21.6,3.85 SW_ENT.2 21.6,4.04 | 21.6,4.04 21.6,4.67 C31.2 | v25.16,4.04 25.16,4.8 24.59,5.37 22.36,5.37 R8.1 | 21.6,4.04 v20.84,4.04
  Bottom 0.127: v20.84,4.04 v25.16,4.04
P1.01/1.6C
  Top 0.127: R_PWR_EPD.1 15.13,11.47 15,11.47 14.43,12.04 12.65,12.04 12.01,11.4 DMG2305UX-7.1
P1.02/1.6C  (via drill 0.3)  (1 unrouted)
  Top 0.127: v26.68,4.74 32.59,4.74 C29.2 | v11.32,3.21 10.62,3.91 SW_DN.2
  Bottom 0.127: v26.68,4.74 26.49,4.74 25.16,3.4 11.51,3.4 v11.32,3.21
PMIC_INT  (1 unrouted)
PREVGH  (via drill 0.3)
  Top 0.127: v7.63,15.09 8.71,15.09 9.22,15.6 EPD_C9.2 | v9.92,13.63 10.24,13.31 10.62,13.31 J1.21 | v16.78,15.28 18.81,15.28 D5.1
  Bottom 0.127: v7.63,15.09 8.46,15.09 v9.92,13.63 9.92,13.69 10.62,13.69 12.21,15.28 v16.78,15.28
PREVGL
  Top 0.127: 11.16,12.01 10.94,12.23 10.68,12.23 J1.23 | 11.16,12.01 11.19,11.98 11.19,11.53 11.06,11.4 10.17,11.4 9.54,12.04 9.28,12.04 EPD_C11.2 | 11.16,12.01 11.44,12.29 15.44,12.29 17.29,14.13 18.68,14.13 D2.2
RESE  (via drill 0.3)
  Top 0.127: v12.4,21.44 12.33,21.5 11.32,21.5 R1_EP_DR.2 | v12.4,23.15 12.21,23.15 11.7,22.64 Q3.2 11.25,22.58 10.94,22.26 10.68,22.26 J1.3
  Bottom 0.127: v12.4,23.15 v12.4,21.44
RESET  (via drill 0.3)  (1 unrouted)
  Top 0.127: v39.57,10.13 40.02,10.58 40.14,10.58 J2.6 | v32.78,16.29 31.83,17.25 TP_RESET.TP
  Bottom 0.127: v39.57,10.13 39.57,10.32 37.86,12.04 37.86,13.18 34.75,16.29 v32.78,16.29
SCL/1.4C  (via drill 0.3)
  Top 0.127: v29.29,8.74 29.29,9.24 IC2.C1 | v28.14,31.34 12.21,31.34 10.3,29.44 10.3,28.61 10.62,28.3 10.87,28.3 U3.7
  Bottom 0.127: v29.29,8.74 29.41,8.74 31.51,10.83 34.3,10.83 34.56,11.09 34.56,13.88 32.34,16.1 32.34,18.33 37.35,23.34 37.35,26.33 32.34,31.34 v28.14,31.34
SCL/2.4C  (via drill 0.3)  (1 unrouted)
  Top 0.127: IC1.B1 16.71,27.41 16.65,27.41 16.4,27.66 16.4,27.79 16.14,28.04 15.19,28.04 14.74,27.6 14.74,24.61 17.73,21.63 R4.1 18.81,21.56 18.94,21.56 v19.38,21.12 | v24.46,9.63 25.22,8.86 25.6,8.86 IC3.12 | v22.55,11.53 21.35,12.74 TP1.TP 21.29,12.8 20.65,13.44 19.76,13.44 R17.2
  Bottom 0.127: v24.46,9.63 v22.55,11.53 19.95,11.53 19.38,12.1 v19.38,21.12
SDA/1.4C  (1 unrouted)
SDA/2.4C  (via drill 0.3)  (1 unrouted)
  Top 0.127: v17.48,25.18 16.4,26.26 16.4,26.64 16.65,26.9 16.71,26.9 IC1.C1 | v17.48,20.74 18.55,19.66 R2.1 | R18.2 18.55,11.47 v19.06,11.47 20.4,11.47 TP2.TP 21.6,10.2 20.21,8.8 20.21,7.15 20.91,6.45 24.65,6.45 26.11,7.91 26.11,8.29 IC3.2
  Bottom 0.127: v17.48,25.18 v17.48,20.74 17.48,16.23 19.06,14.64 v19.06,11.47
SWDCLK  (via drill 0.3)
  Top 0.127: U1.P$AA24 34.3,20.74 39.7,20.74 42.81,17.63 TP_SWDCLK.TP 42.81,17.56 v42.81,13.69 | v38.43,10.01 38.88,10.45 38.88,10.58 J2.4
  Bottom 0.127: v38.43,10.01 39.07,10.01 39.38,9.69 39.76,9.69 40.59,10.52 40.59,11.47 v42.81,13.69
SWDIO
  Top 0.127: U1.P$AC24 34.3,20.23 36.65,20.23 39.38,17.5 TP_SWDIO.TP 39.38,17.44 39.38,15.85 37.99,14.45 37.99,12.1 37.67,11.79 37.67,10.64 J2.2
SWO
  Top 0.127: U1.P$AD22 33.29,19.72 33.29,18.39 34.37,17.31 TP_SWO.TP
VBAT/1.2A  (via drill 0.3)
  Top 0.3: U3.3 12.9,28.74 12.9,28.36 U3.2 12.9,28.23 13.35,28.23 13.47,28.1 14.05,28.1 C27.2 14.11,27.98 v14.11,24.87 | v23.45,10.01 24.08,10.01 25.73,11.66 27.19,11.66 27.76,12.23 30.56,12.23 TP_VBAT.TP
  Bottom 0.3: v14.11,24.87 14.11,19.09 18.55,14.64 18.55,11.21 19.76,10.01 v23.45,10.01
VBAT/2.5C
  Top 0.3: IC1.C2 17.16,26.96 17.41,26.96 17.6,26.77 18.24,26.77 18.36,26.9 18.36,27.47 18.11,27.72 C37.1
VBUS/1.5D  (via drill 0.3)
  Top 0.3: 26.14,13.47 25.67,12.99 25.29,12.99 24.65,12.36 C43.1 | 26.14,13.47 26.37,13.69 27.7,13.69 C42.1 | v20.65,28.04 20.65,28.93 J4.A9_B4 | v24.97,28.04 25.35,28.42 25.35,28.93 J4.A4_B9 | v25.03,16.8 25.54,16.29 25.98,16.29 D3.5 | v26.05,13.56 26.14,13.47
  Bottom 0.3: 22.55,28.04 22.75,28.04 22.81,28.1 24.91,28.1 v24.97,28.04 | 22.55,28.04 v20.65,28.04 | 22.55,28.04 22.55,27.34 25.03,24.87 v25.03,16.8 25.09,16.67 26.05,15.72 v26.05,13.56
VBUS/2.6D  (via drill 0.3)
  Top 0.3: 28.27,19.28 28.27,19.72 U1.P$AD2 | 28.27,19.28 28.46,19.09 C21.1 | v16.59,28.23 16.84,28.23 17.16,27.91 17.16,27.79 IC1.A2 | C38.1 15.95,27.6 v15.38,27.6 15.51,27.47 15.51,26.84 15.57,26.77 v15.57,26.33 | v27.51,18.71 28.02,19.21 28.14,19.21 28.27,19.28
  Bottom 0.3: v16.59,28.23 16.02,28.23 v15.38,27.6 | v27.51,18.71 27.51,20.29 25.79,22.01 25.79,28.36 25.29,28.87 19.76,28.87 17.22,26.33 v15.57,26.33
VREG  (via drill 0.3)  (1 unrouted)
  Top 0.127: 20.65,21.25 20.46,21.25 IC9.A2 20.4,21.25 20.08,21.25 IC9.A1 20.02,21.31 19.38,21.95 18.36,21.95 15.32,24.99 C39.1 | 20.65,21.25 20.78,21.25 IC9.A3 | v22.24,20.17 21.73,20.17 C23.2 | 20.65,21.25 v20.65,21.75 | v15.44,22.2 15.44,21.18 C24.2 | v19.82,12.99 18.81,12.99 15.89,10.07 15.89,8.74 TP_VREG.TP
  Bottom 0.127: 21.64,20.77 v20.65,21.75 20.65,22.64 17.67,25.63 17.29,25.63 15.44,23.79 v15.44,22.2 | 21.64,20.77 v22.24,20.17 | v19.82,12.99 19.82,18.96 21.64,20.77